# EAGLE design 612_jetracer_esp32s3_030100 (EAGLE 9.6.2)
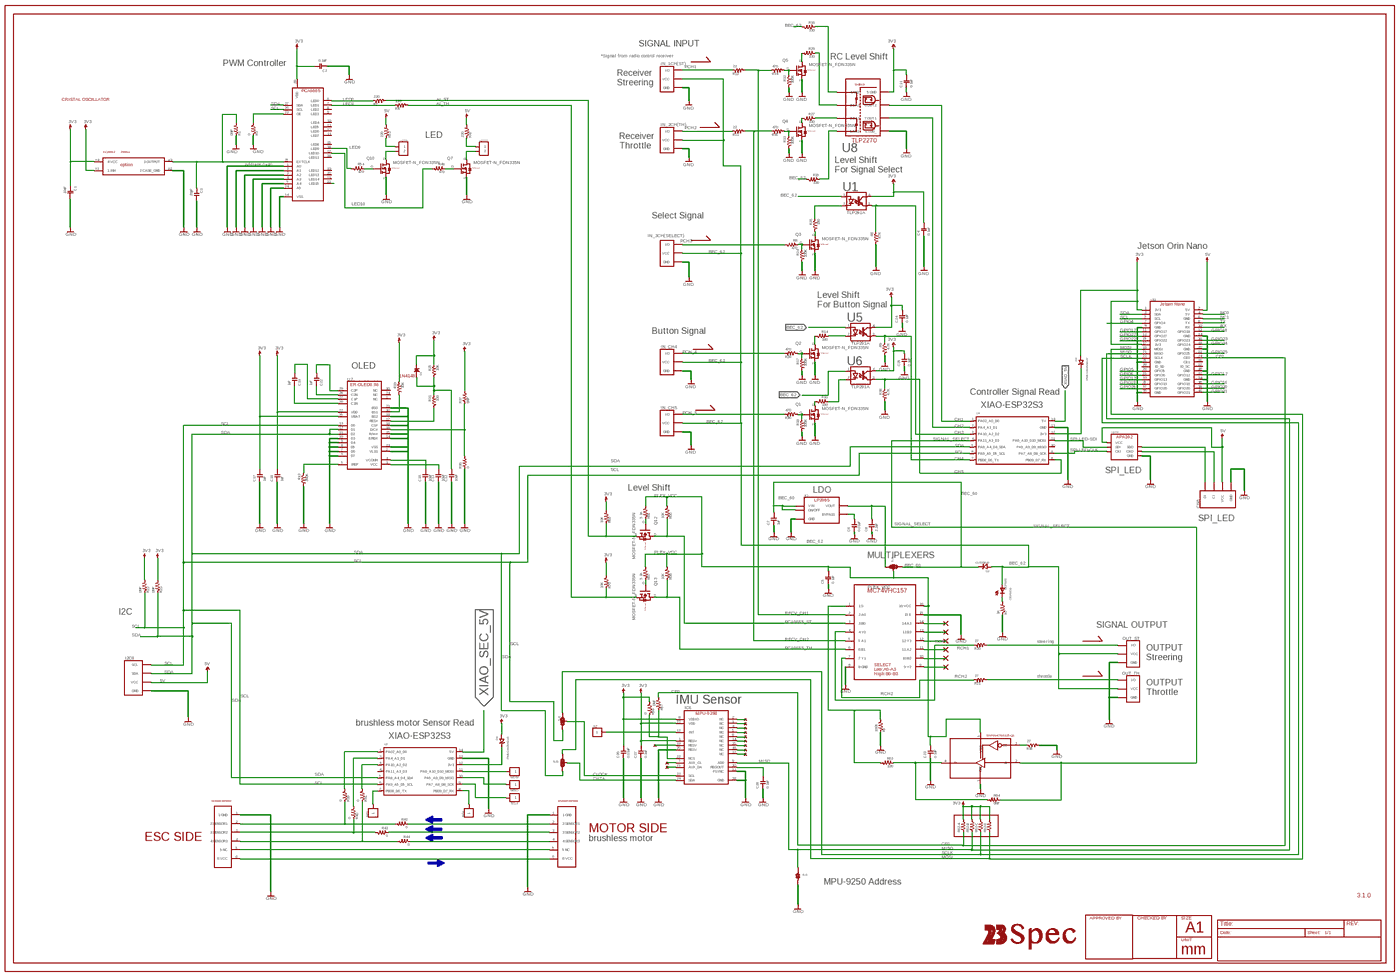
[diagram p0: schematic, sheet 1, overview]
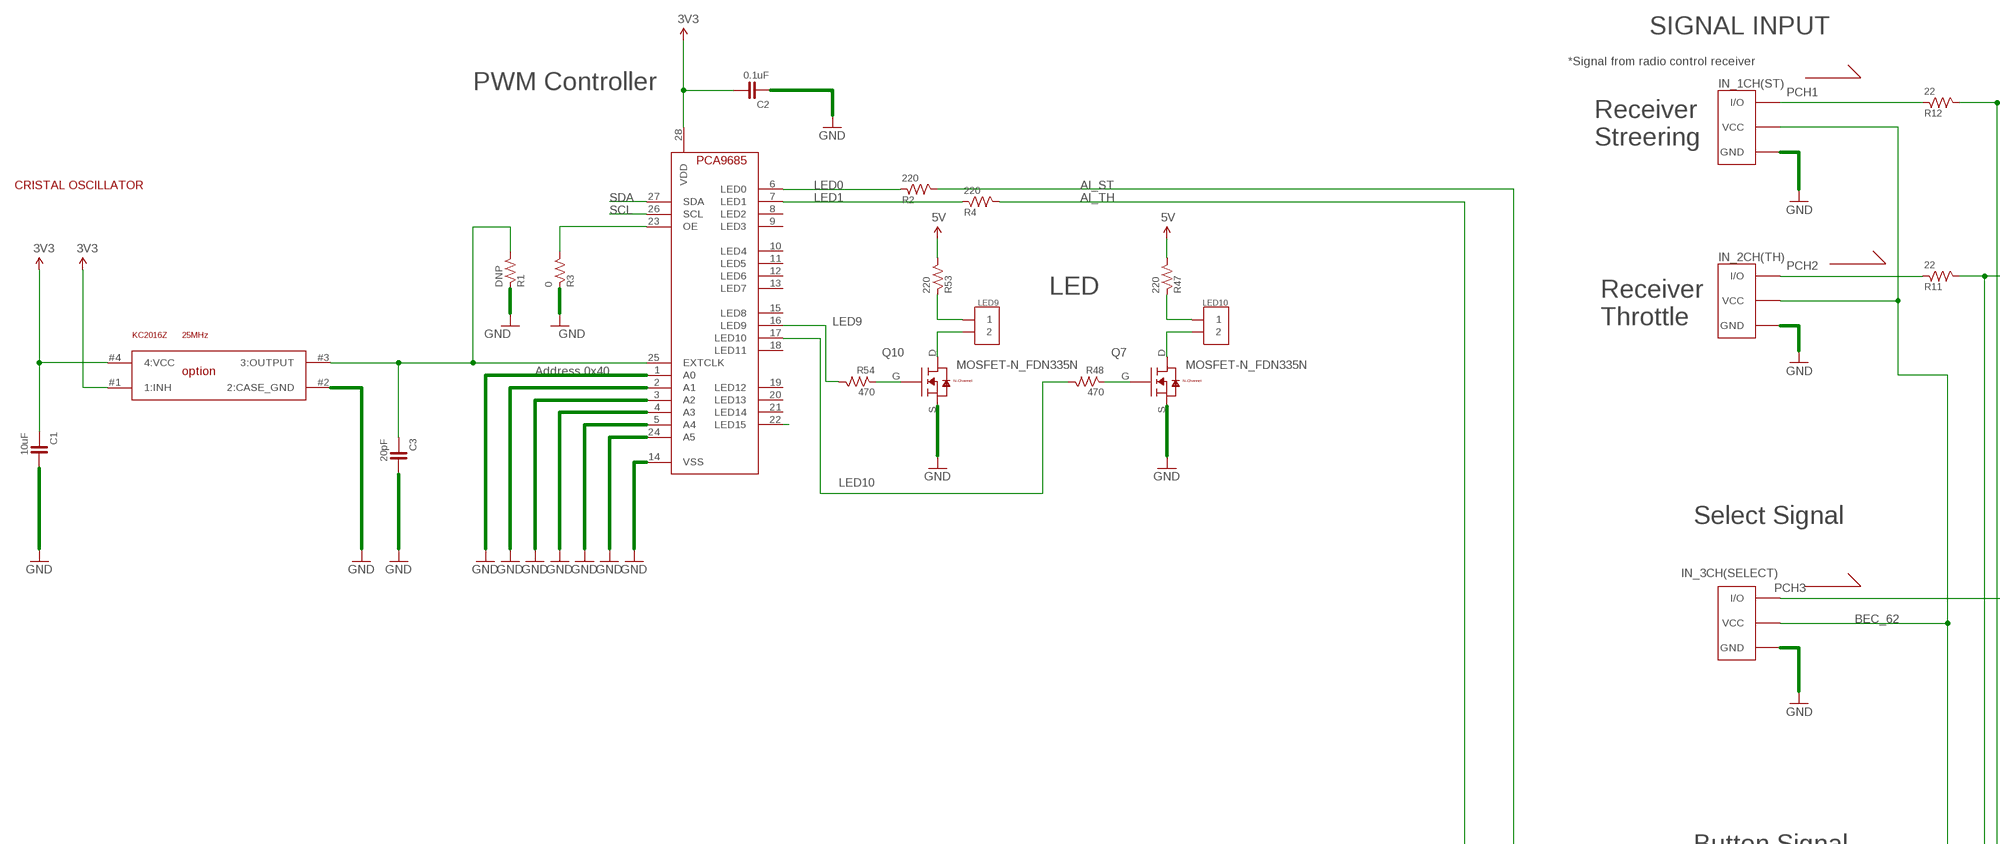
[diagram p1: schematic, sheet 1, part 1 of 4]
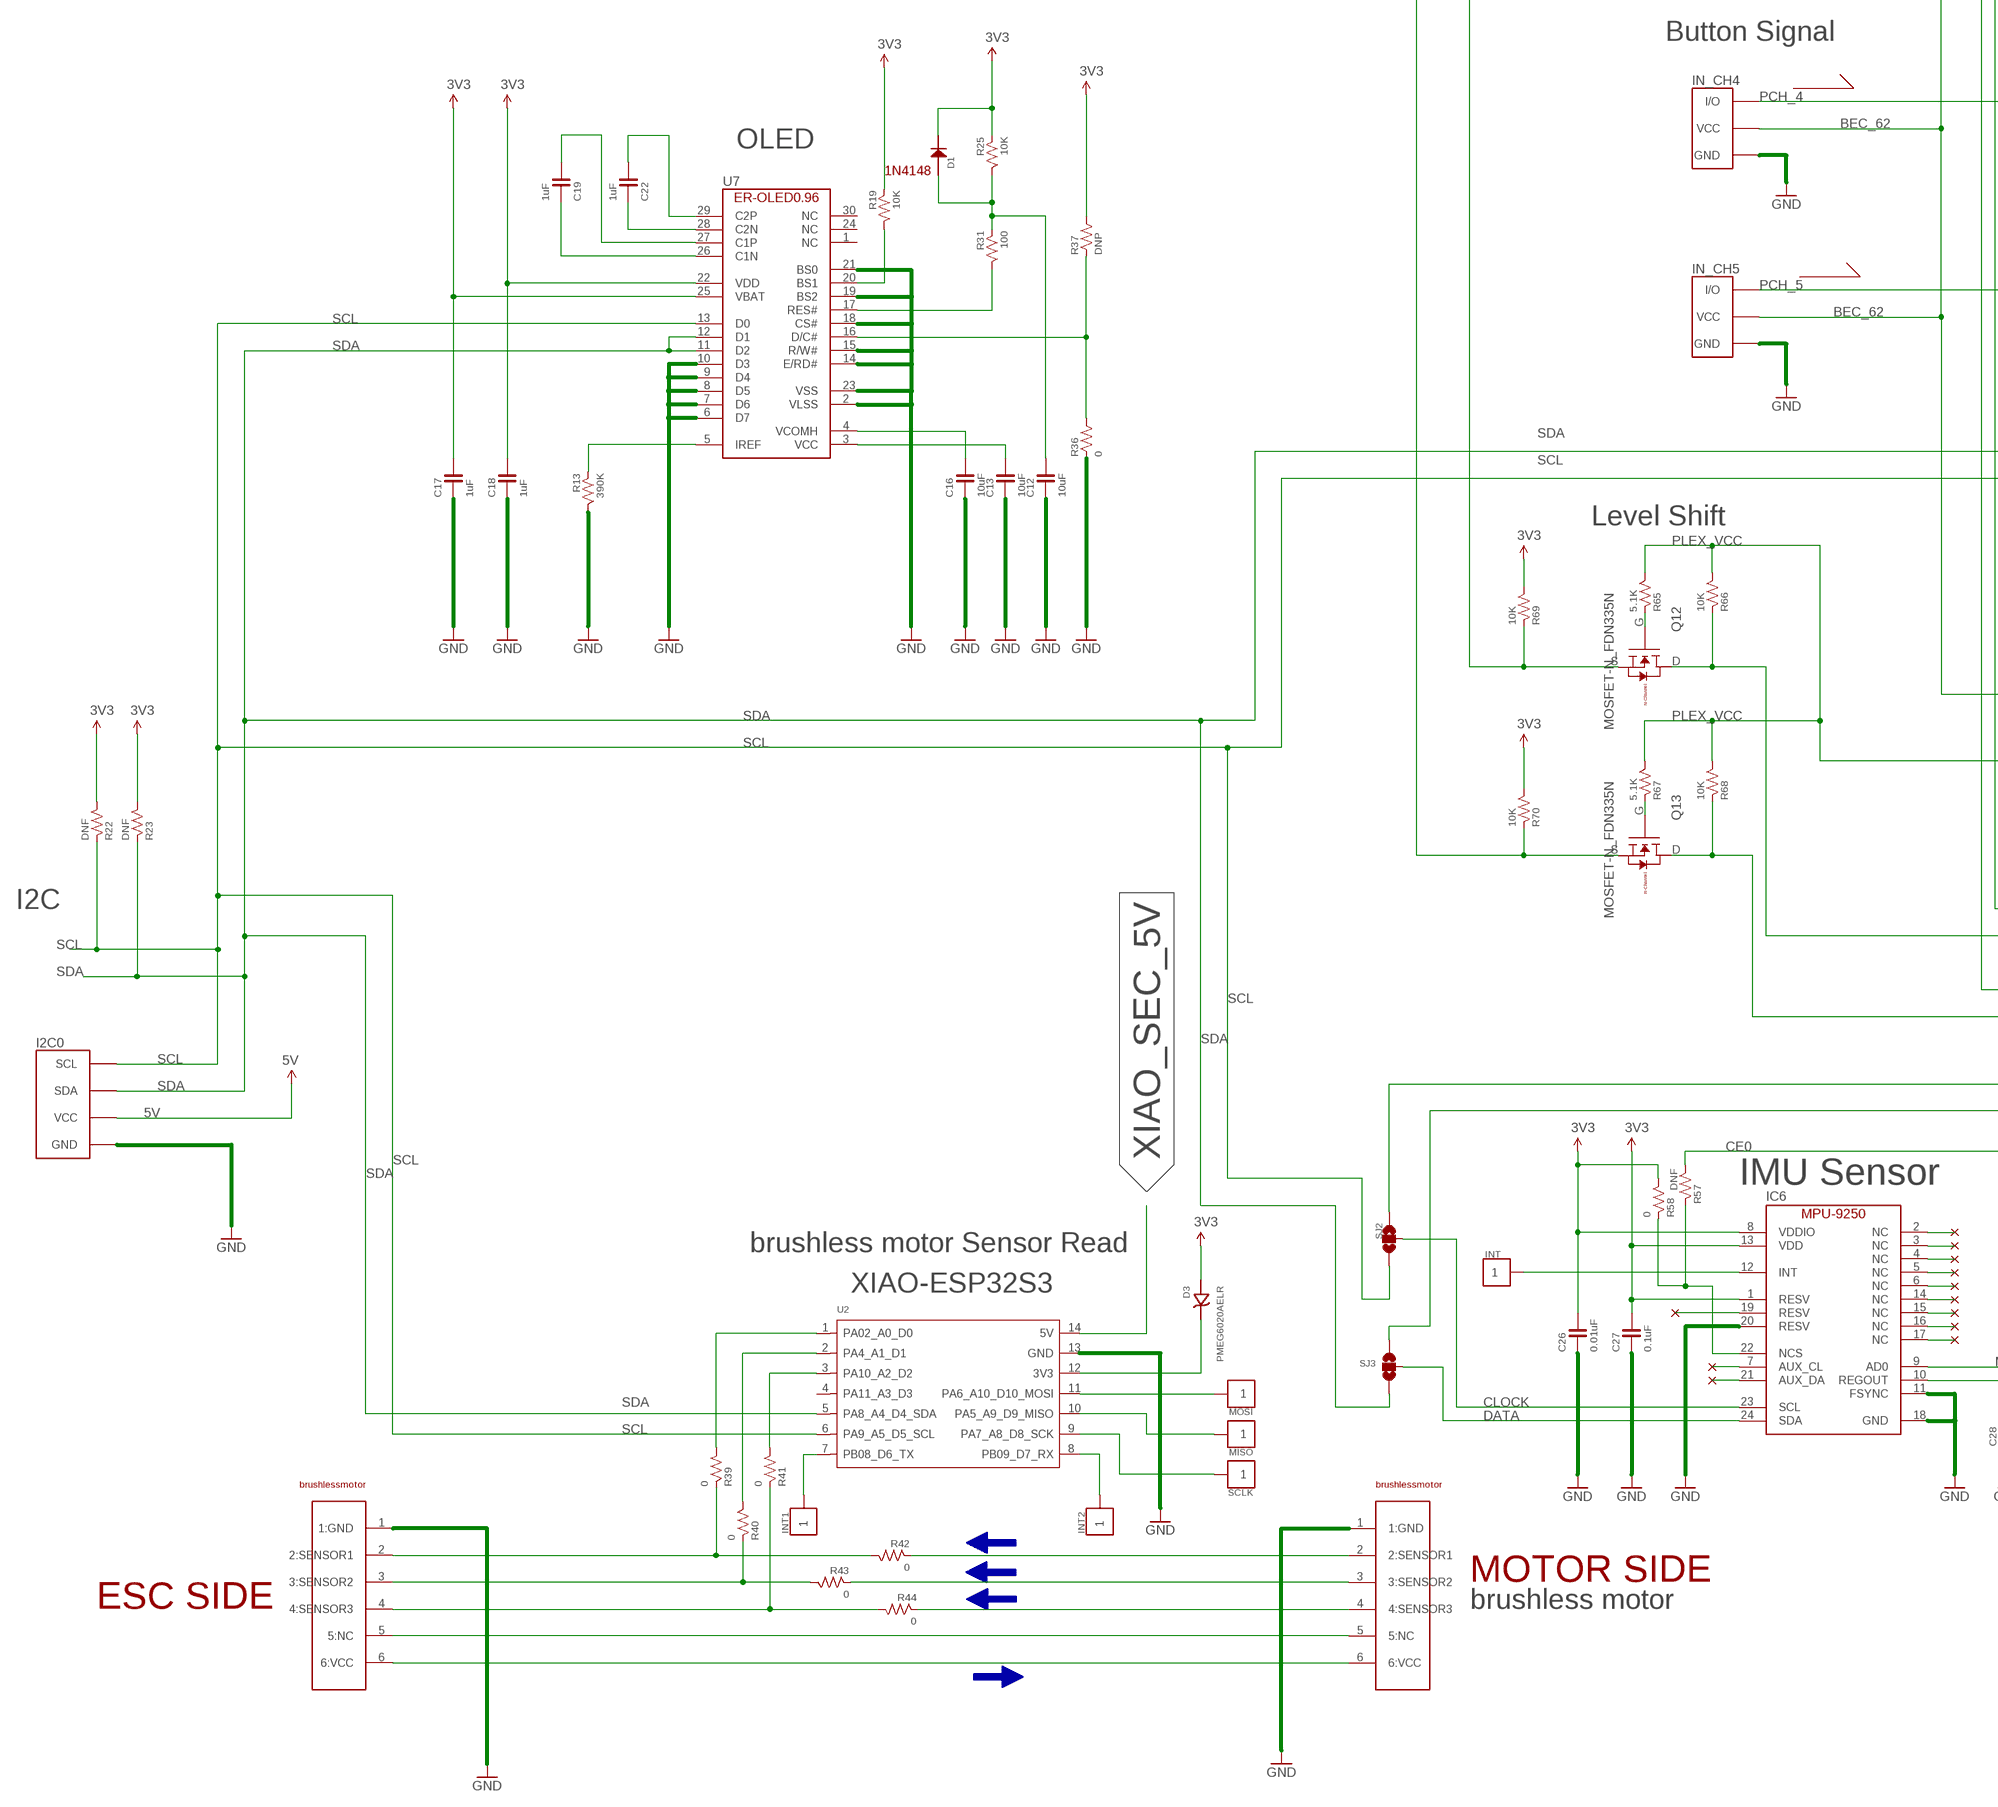
[diagram p2: schematic, sheet 1, part 2 of 4]
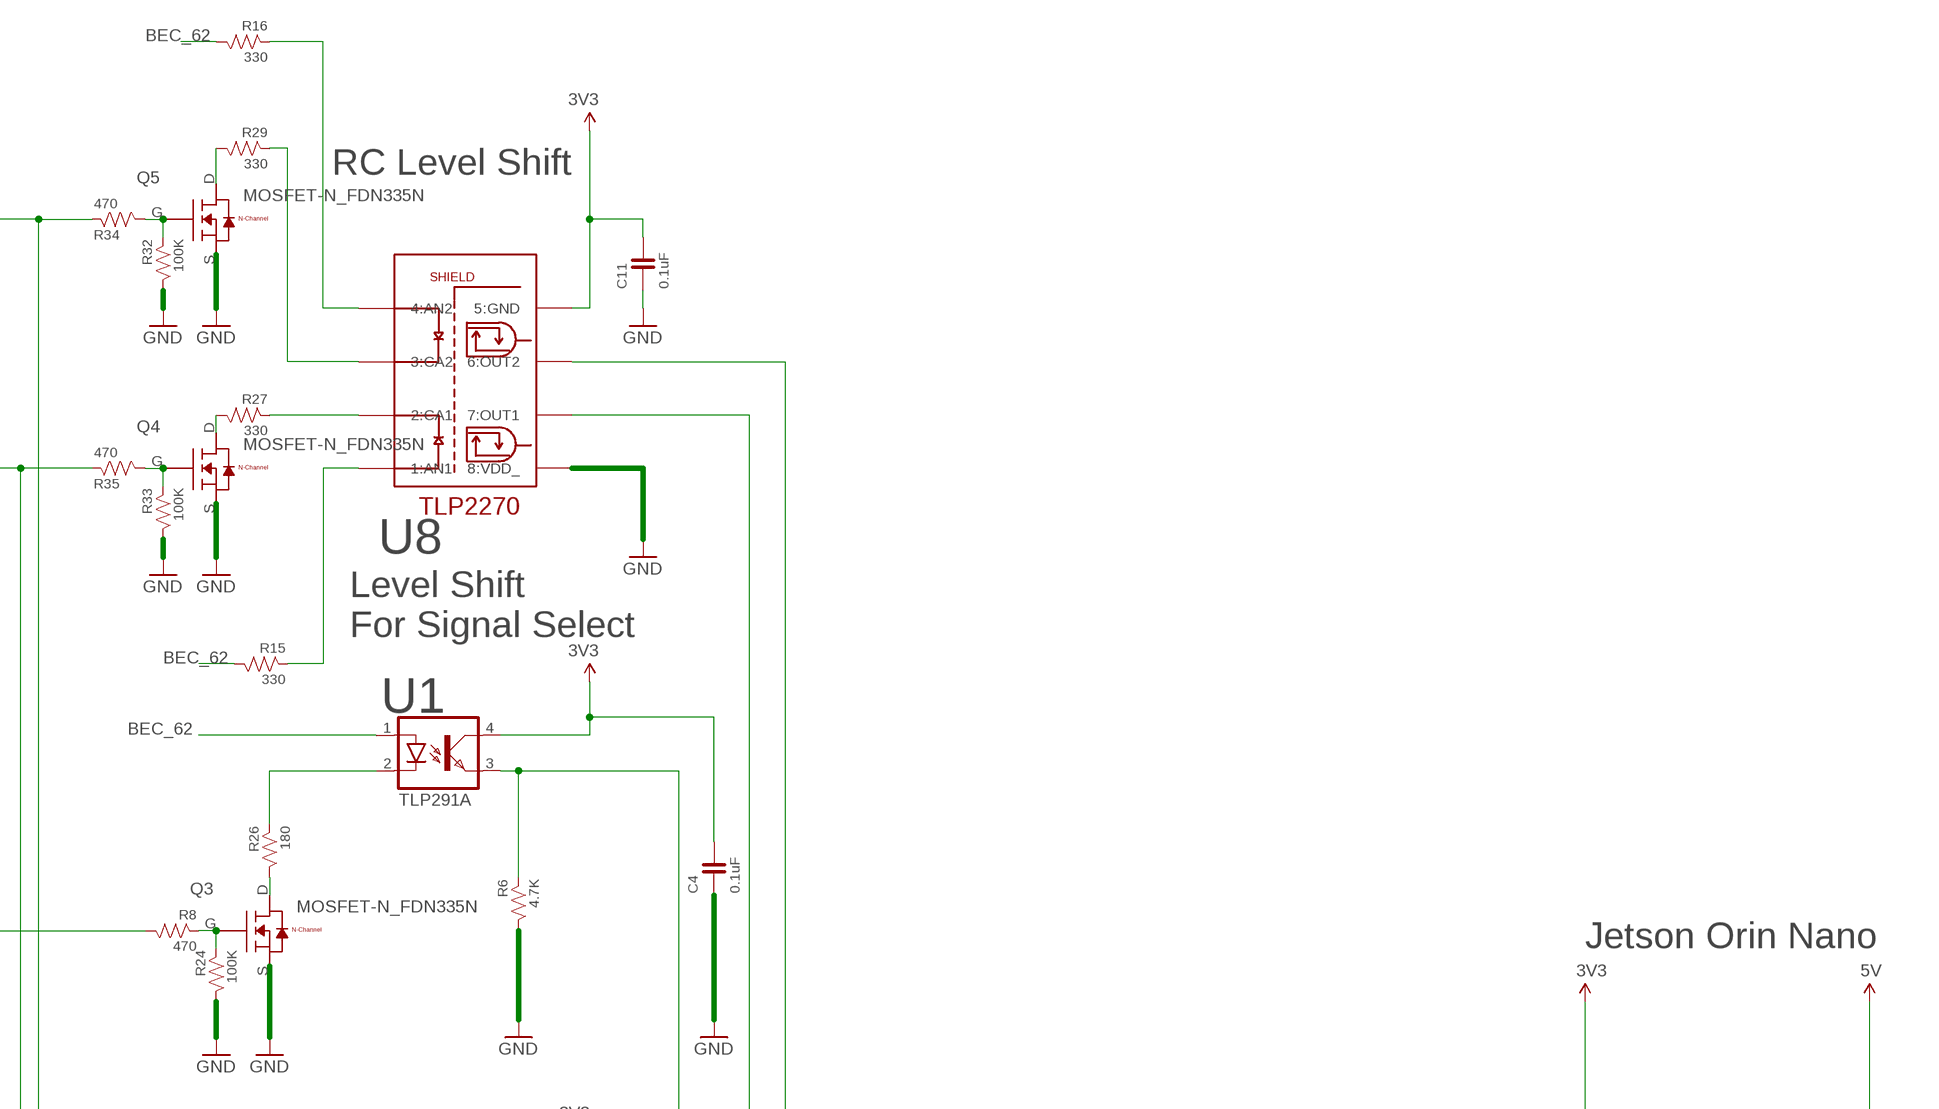
[diagram p3: schematic, sheet 1, part 3 of 4]
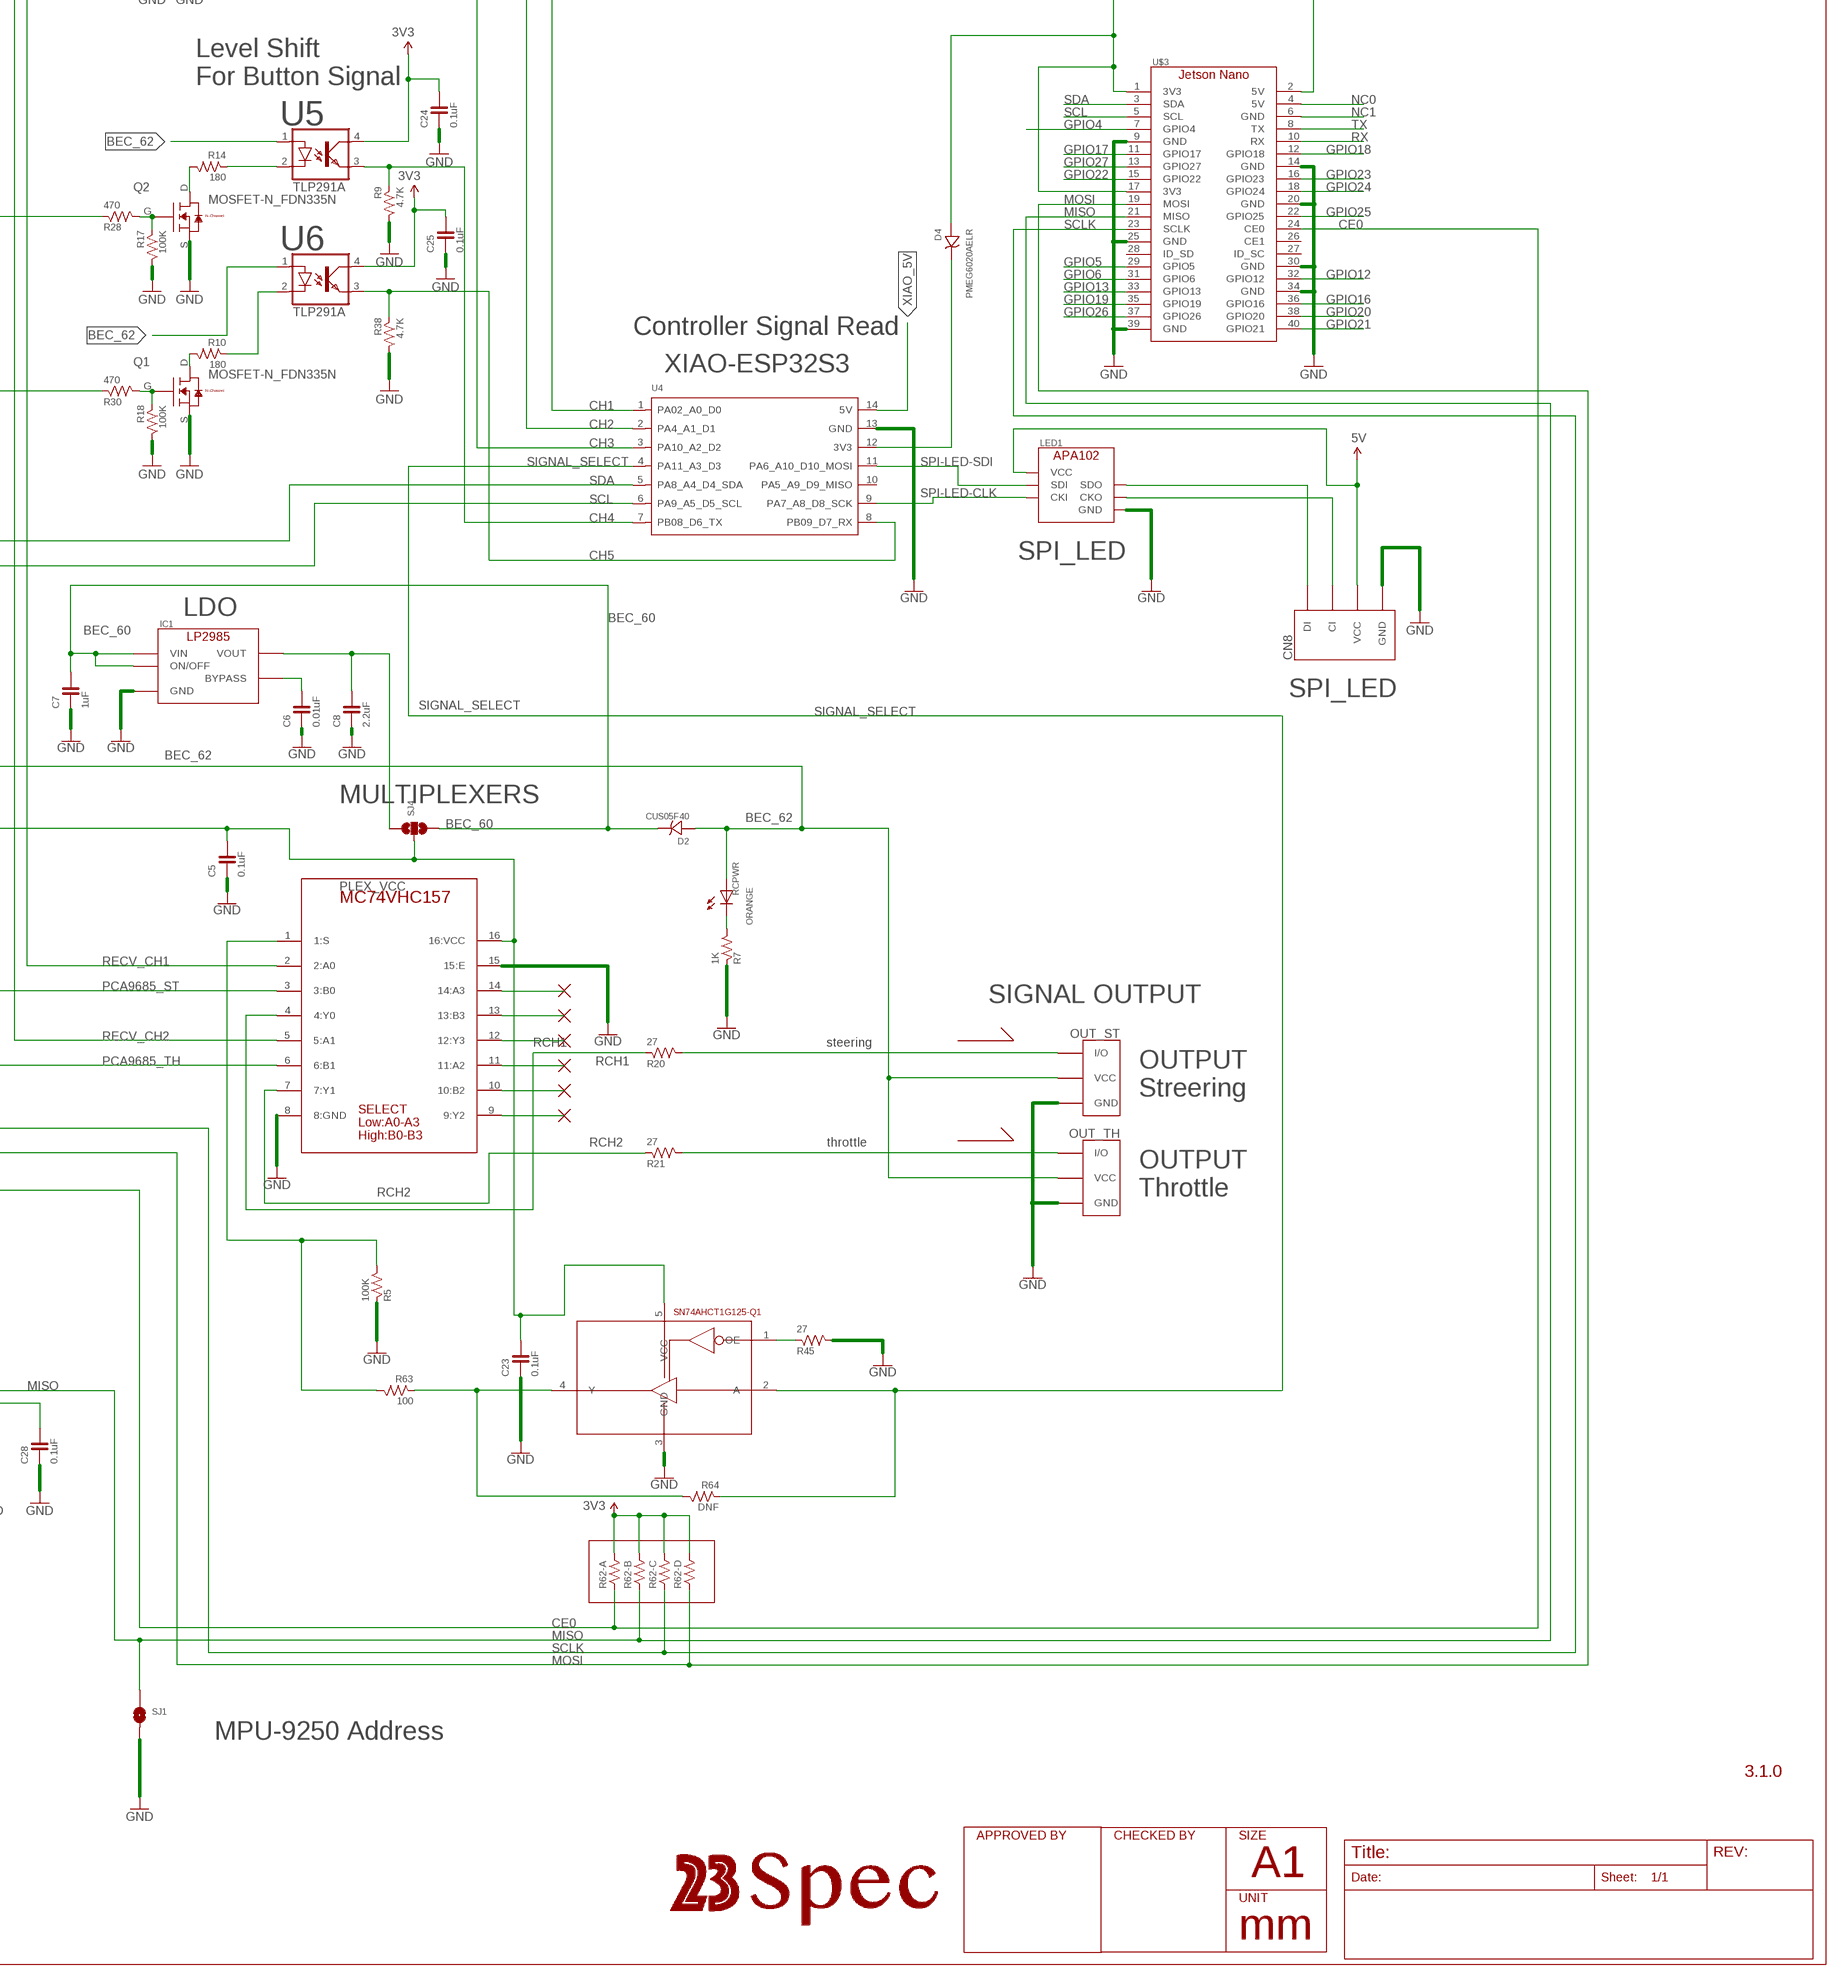
[diagram p4: schematic, sheet 1, part 4 of 4]

## Parts
C1  10uF  CAPACITOR-0603  [0603]
C2  0.1uF  CAPACITOR-0603  [0603]
C3  20pF  CAPACITOR-0603  [0603]
C4  0.1uF  CAPACITOR-0603  [0603]
C5  0.1uF  CAPACITOR-0603  [0603]
C6  0.01uF  CAPACITOR-0603  [0603]
C7  1uF  CAPACITOR-0603  [0603]
C8  2.2uF  CAPACITOR-0603  [0603]
C11  0.1uF  CAPACITOR-0603  [0603]
C12  10uF  CAPACITOR-0603  [0603]
C13  10uF  CAPACITOR-0603  [0603]
C16  10uF  CAPACITOR-0603  [0603]
C17  1uF  CAPACITOR-0603  [0603]
C18  1uF  CAPACITOR-0603  [0603]
C19  1uF  CAPACITOR-0603  [0603]
C22  1uF  CAPACITOR-0603  [0603]
C23  0.1uF  CAPACITOR-0603  [0603]
C24  0.1uF  CAPACITOR-0603  [0603]
C25  0.1uF  CAPACITOR-0603  [0603]
C26  0.01uF  CAPACITOR-0603  [0603]
C27  0.1uF  CAPACITOR-0603  [0603]
C28  0.1uF  CAPACITOR-0603  [0603]
CN8  FABO-SPI-LED-B04B  [SPI-B04B-PASK-1]
D1  1N4148  [1N4148W]
D2  CUS05F40  [CUS05F40]
D3  PMEG6020AELR  [SOD123W]
D4  PMEG6020AELR  [SOD123W]
I2C0  FABO_BRICK_I2C-B04B-PASK-1  [FABO_BRICK_I2C_B04B-PASK-1]
IC1  LP2985-33DBV  [SOT-23-5]
IC4  PCA9685_BOTTOM  [PCA9685_BOTTOM]
IC6  IS-MPU9250  [INVENSENSE-MPU9250]
IN_1CH(ST)  FABO_BRICK_3PIN-HEADER  [FABO_BRICK_3PIN_HEADER]
IN_2CH(TH)  FABO_BRICK_3PIN-HEADER  [FABO_BRICK_3PIN_HEADER]
IN_3CH(SELECT)  FABO_BRICK_3PIN-HEADER  [FABO_BRICK_3PIN_HEADER]
IN_CH4  FABO_BRICK_3PIN-HEADER  [FABO_BRICK_3PIN_HEADER]
IN_CH5  FABO_BRICK_3PIN-HEADER  [FABO_BRICK_3PIN_HEADER]
INT  PIN_1X1  [PIN_1X1]
INT1  PIN_1X1  [PIN_1X1]
INT2  PIN_1X1  [PIN_1X1]
LED1  APA102_IPIXEL  [APA102_2020]
LED9  PIN_1X2  [PIN_1X2]
LED10  PIN_1X2  [PIN_1X2]
MISO  PIN_1X1  [PIN_1X1]
MOSI  PIN_1X1  [PIN_1X1]
OUT_ST  FABO_BRICK_3PIN-HEADER  [FABO_BRICK_3PIN_HEADER]
OUT_TH  FABO_BRICK_3PIN-HEADER  [FABO_BRICK_3PIN_HEADER]
Q1  MOSFET-N_FDN335N  [SUPERSOT-3]
Q2  MOSFET-N_FDN335N  [SUPERSOT-3]
Q3  MOSFET-N_FDN335N  [SUPERSOT-3]
Q4  MOSFET-N_FDN335N  [SUPERSOT-3]
Q5  MOSFET-N_FDN335N  [SUPERSOT-3]
Q7  MOSFET-N_FDN335N  [SUPERSOT-3]
Q10  MOSFET-N_FDN335N  [SUPERSOT-3]
Q12  MOSFET-N_FDN335N  [SUPERSOT-3]
Q13  MOSFET-N_FDN335N  [SUPERSOT-3]
R1  DNP  RESISTOR-0603  [0603]
R2  220  RESISTOR-0603  [0603]
R3  0  RESISTOR-0603  [0603]
R4  220  RESISTOR-0603  [0603]
R5  100K  RESISTOR-0603  [0603]
R6  4.7K  RESISTOR-0603  [0603]
R7  1K  RESISTOR-0603  [0603]
R8  470  RESISTOR-0603  [0603]
R9  4.7K  RESISTOR-0603  [0603]
R10  180  RESISTOR-0603  [0603]
R11  22  RESISTOR-0603  [0603]
R12  22  RESISTOR-0603  [0603]
R13  390K  RESISTOR-0603  [0603]
R14  180  RESISTOR-0603  [0603]
R15  330  RESISTOR-0603  [0603]
R16  330  RESISTOR-0603  [0603]
R17  100K  RESISTOR-0603  [0603]
R18  100K  RESISTOR-0603  [0603]
R19  10K  RESISTOR-0603  [0603]
R20  27  RESISTOR-0603  [0603]
R21  27  RESISTOR-0603  [0603]
R22  DNF  RESISTOR-0603  [0603]
R23  DNF  RESISTOR-0603  [0603]
R24  100K  RESISTOR-0603  [0603]
R25  10K  RESISTOR-0603  [0603]
R26  180  RESISTOR-0603  [0603]
R27  330  RESISTOR-0603  [0603]
R28  470  RESISTOR-0603  [0603]
R29  330  RESISTOR-0603  [0603]
R30  470  RESISTOR-0603  [0603]
R31  100  RESISTOR-0603  [0603]
R32  100K  RESISTOR-0603  [0603]
R33  100K  RESISTOR-0603  [0603]
R34  470  RESISTOR-0603  [0603]
R35  470  RESISTOR-0603  [0603]
R36  0  RESISTOR-0805  [0805]
R37  DNP  RESISTOR-0805  [0805]
R38  4.7K  RESISTOR-0603  [0603]
R39  0  RESISTOR-0603  [0603]
R40  0  RESISTOR-0603  [0603]
R41  0  RESISTOR-0603  [0603]
R42  0  RESISTOR-0603  [0603]
R43  0  RESISTOR-0603  [0603]
R44  0  RESISTOR-0603  [0603]
R45  27  RESISTOR-0603  [0603]
R47  220  RESISTOR-0603  [0603]
R48  470  RESISTOR-0603  [0603]
R53  220  RESISTOR-0603  [0603]
R54  470  RESISTOR-0603  [0603]
R57  DNF  RESISTOR-0603  [0603]
R58  0  RESISTOR-0603  [0603]
R62  RESISTOR_ARRAY_4  [EXBV8V]
R63  100  RESISTOR-0603  [0603]
R64  DNF  RESISTOR-0603  [0603]
R65  5.1K  RESISTOR-0603  [0603]
R66  10K  RESISTOR-0603  [0603]
R67  5.1K  RESISTOR-0603  [0603]
R68  10K  RESISTOR-0603  [0603]
R69  10K  RESISTOR-0603  [0603]
R70  10K  RESISTOR-0603  [0603]
RCPWR  ORANGE  LED-0603  [0603]
SCLK  PIN_1X1  [PIN_1X1]
SJ1  FABO-SMD-JUMPER-SELECT  [SMD-JUMPER_SELECT]
SJ2  SMD-JUMPER-3_23SHORT  [SMD-JUMPER-3-23SHORT]
SJ3  SMD-JUMPER-3_23SHORT  [SMD-JUMPER-3-23SHORT]
SJ4  SMD-JUMPER-3_23SHORT  [SMD-JUMPER-3-23SHORT]
U1  TLP291A  [11-3C1]
U2  MOUDLE-SEEEDUINO-XIAO-ESP32S3-SMD  [MOUDLE14P-SMD-2.54-21X17.8MM]
U4  MOUDLE-SEEEDUINO-XIAO-ESP32S3-SMD  [MOUDLE14P-SMD-2.54-21X17.8MM]
U5  TLP291A  [11-3C1]
U6  TLP291A  [11-3C1]
U7  ER-OLED0.96-1ER-CON30HT-1  [ER-CON30HT-1]
U8  TLP2270  [TLP2270]
U$1  MC74VHC157  [MC74VHC157_TSSOP-16]
U$3  JETSON_NANOJETSON_ORIN_NANO  [JETSON_ORIN_NANO_DIMENTION]
U$8  SN74AHCT1G125-Q1  [SC70]
U$9  BRUSHLESSMOTOR_CON  [B6B-ZR]
U$10  BRUSHLESSMOTOR_CON  [B6B-ZR]
U$11  KC2016Z  [KC2016Z]

## Nets
3V3: C1.1 C2.2 C4.2 C11.2 C17.2 C18.2 C24.2 C25.2 C26.2 C27.2 D1.CATHODE D3.2(ANODE) D4.2(ANODE) IC4.28(VDD) IC6.1(RESV) IC6.8(VDDIO) IC6.13(VDD) R19.1 R22.2 R23.2 R25.1 R37.2 R58.2 R62.5 R62.6 R62.7 R62.8 R69.2 R70.2 U1.4(COL) U5.4(COL) U6.4(COL) U7.22(VDD) U7.25(VBAT) U8.5(5:GND) U$3.1(3V3) U$3.17(3V3) U$11.#1(1:INH) U$11.#4(4:VCC)
5V: CN8.VCC I2C0.VCC LED1.VCC R47.2 R53.2 U$3.2(5V)
AI_ST: Q12.S R2.2 R69.1
AI_TH: Q13.S R4.2 R70.1
BEC_60: C7.2 D2.C(CATHODE) IC1.1(VIN) IC1.3(ON/OFF) SJ4.3
BEC_62: D2.A(ANODE) IN_1CH(ST).VCC IN_2CH(TH).VCC IN_3CH(SELECT).VCC IN_CH4.VCC IN_CH5.VCC OUT_ST.VCC OUT_TH.VCC R15.2 R16.2 RCPWR.ANODE U1.1(A) U5.1(A) U6.1(A)
CE0: R57.2 R62.1 U$3.24(CE0)
CH1: U4.1(PA02_A0_D0) U8.6(6:OUT2)
CH2: U4.2(PA4_A1_D1) U8.7(7:OUT1)
CH3: R6.1 U1.3(EMI) U4.3(PA10_A2_D2)
CH4: R9.1 U4.7(PB08_D6_TX) U5.3(EMI)
CH5: R38.1 U4.8(PB09_D7_RX) U6.3(EMI)
CLOCK: IC6.23(SCL) SJ2.2
DATA: IC6.24(SDA) SJ3.2
GND: C1.2 C2.1 C3.2 C4.1 C5.1 C6.1 C7.1 C8.1 C11.1 C12.1 C13.1 C16.1 C17.1 C18.1 C23.1 C24.1 C25.1 C26.1 C27.1 C28.1 CN8.GND I2C0.GND IC1.2(GND) IC4.1(A0) IC4.2(A1) IC4.3(A2) IC4.4(A3) IC4.5(A4) IC4.14(VSS) IC4.24(A5) IC6.11(FSYNC) IC6.18(GND) IC6.20(RESV) IN_1CH(ST).GND IN_2CH(TH).GND IN_3CH(SELECT).GND IN_CH4.GND IN_CH5.GND LED1.GND OUT_ST.GND OUT_TH.GND Q1.S Q2.S Q3.S Q4.S Q5.S Q7.S Q10.S R1.1 R3.1 R5.1 R6.2 R7.1 R9.2 R13.2 R17.2 R18.2 R24.2 R32.2 R33.2 R36.1 R38.2 R45.2 SJ1.2 U2.13(GND) U4.13(GND) U7.2(VLSS) U7.6(D7) U7.7(D6) U7.8(D5) U7.9(D4) U7.10(D3) U7.14(E/RD#) U7.15(R/W#) U7.18(CS#) U7.19(BS2) U7.21(BS0) U7.23(VSS) U8.8(8:VDD_) U$1.8(8:GND) U$1.15(15:E) U$3.9(GND) U$3.14(GND) U$3.20(GND) U$3.25(GND) U$3.30(GND) U$3.34(GND) U$3.39(GND) U$8.3(GND) U$9.1(1:GND) U$10.1(1:GND) U$11.#2(2:CASE_GND)
GPIO4: U$3.7(GPIO4)
GPIO5: U$3.29(GPIO5)
GPIO6: U$3.31(GPIO6)
GPIO12: U$3.32(GPIO12)
GPIO13: U$3.33(GPIO13)
GPIO16: U$3.36(GPIO16)
GPIO17: U$3.11(GPIO17)
GPIO18: U$3.12(GPIO18)
GPIO19: U$3.35(GPIO19)
GPIO20: U$3.38(GPIO20)
GPIO21: U$3.40(GPIO21)
GPIO22: U$3.15(GPIO22)
GPIO23: U$3.16(GPIO23)
GPIO24: U$3.18(GPIO24)
GPIO25: U$3.22(GPIO25)
GPIO26: U$3.37(GPIO26)
GPIO27: U$3.13(GPIO27)
LED0: IC4.6(LED0) R2.1
LED1: IC4.7(LED1) R4.1
LED9: IC4.16(LED9) R54.2
LED9-D: LED9.2 Q10.D
LED9_G: Q10.G R54.1
LED10: IC4.17(LED10) R48.2
LED10-D: LED10.2 Q7.D
LED10-G: Q7.G R48.1
MISO: IC6.9(AD0) R62.2 SJ1.1 U$3.21(MISO)
MOSI: R62.4 SJ3.1 U$3.19(MOSI)
MOTORCONTROLPOWER: U$9.6(6:VCC) U$10.6(6:VCC)
N$2: IC6.22(NCS) R57.1 R58.1
N$3: C22.2 U7.29(C2P)
N$4: R5.2 R63.2 U$1.1(1:S)
N$5: IC6.12(INT) INT.1
N$6: R26.1 U1.2(C)
N$7: IC4.23(OE) R3.2
N$8: IC6.2(NC)
N$9: R15.1 U8.1(1:AN1)
N$10: IC6.3(NC)
N$11: IC6.4(NC)
N$12: R16.1 U8.4(4:AN2)
N$13: CN8.DI LED1.SDO
N$14: R13.1 U7.5(IREF)
N$15: CN8.CI LED1.CKO
N$16: C19.2 U7.27(C1P)
N$17: C13.2 U7.3(VCC)
N$18: R31.2 U7.17(RES#)
N$19: U$1.13(13:B3)
N$20: R39.1 R42.2 U$9.2(2:SENSOR1)
N$21: C19.1 U7.26(C1N)
N$22: C22.1 U7.28(C2N)
N$23: Q3.G R8.1 R24.1
N$24: R7.2 RCPWR.CATHODE
N$25: C16.2 U7.4(VCOMH)
N$26: Q3.D R26.2
N$27: Q4.D R27.2
N$28: R27.1 U8.2(2:CA1)
N$29: Q5.D R29.2
N$30: R29.1 U8.3(3:CA2)
N$31: R40.1 R43.2 U$9.3(3:SENSOR2)
N$32: C12.2 D1.ANODE R25.2 R31.1
N$33: Q5.G R32.1 R34.2
N$34: D4.1(CATHODE) U4.12(3V3)
N$35: OUT_TH.I/O R21.2
N$36: OUT_ST.I/O R20.2
N$37: R36.2 R37.1 U7.16(D/C#)
N$38: Q4.G R33.1 R35.2
N$39: U$1.11(11:A2)
N$40: R41.1 R44.2 U$9.4(4:SENSOR3)
N$41: C3.1 IC4.25(EXTCLK) R1.2 U$11.#3(3:OUTPUT)
N$42: U$9.5(5:NC) U$10.5(5:NC)
N$43: IC6.5(NC)
N$44: IC6.6(NC)
N$45: D3.1(CATHODE) U2.12(3V3)
N$46: Q1.D R10.2
N$47: Q2.D R14.2
N$48: Q2.G R17.1 R28.2
N$49: Q1.G R18.1 R30.2
N$50: R19.2 U7.20(BS1)
N$51: R14.1 U5.2(C)
N$52: R10.1 U6.2(C)
N$53: IC6.14(NC)
N$54: IC6.15(NC)
N$55: R39.2 U2.1(PA02_A0_D0)
N$56: R40.2 U2.2(PA4_A1_D1)
N$57: R41.2 U2.3(PA10_A2_D2)
N$58: R42.1 U$10.2(2:SENSOR1)
N$59: R43.1 U$10.3(3:SENSOR2)
N$60: R44.1 U$10.4(4:SENSOR3)
N$61: U$1.10(10:B2)
N$62: U$1.9(9:Y2)
N$63: U$1.12(12:Y3)
N$64: R45.1 U$8.1(OE)
N$65: C6.2 IC1.4(BYPASS)
N$66: LED10.1 R47.1
N$67: INT1.1 U2.7(PB08_D6_TX)
N$68: INT2.1 U2.8(PB09_D7_RX)
N$75: LED9.1 R53.1
N$85: IC4.22(LED15)
N$87: MOSI.1 U2.11(PA6_A10_D10_MOSI)
N$88: MISO.1 U2.10(PA5_A9_D9_MISO)
N$89: SCLK.1 U2.9(PA7_A8_D8_SCK)
N$95: R63.1 R64.2 U$8.4(Y)
N$96: Q12.G R65.1
N$97: IC6.16(NC)
N$98: IC6.17(NC)
N$99: Q13.G R67.1
N$100: IC6.7(AUX_CL)
N$105: U$1.14(14:A3)
N$107: IC6.21(AUX_DA)
N$108: IC6.19(RESV)
NC0: U$3.4(5V)
NC1: U$3.6(GND)
PCA9685_ST: Q12.D R66.1 U$1.3(3:B0)
PCA9685_TH: Q13.D R68.1 U$1.6(6:B1)
PCH1: IN_1CH(ST).I/O R12.1
PCH2: IN_2CH(TH).I/O R11.1
PCH3: IN_3CH(SELECT).I/O R8.2
PCH_4: IN_CH4.I/O R28.1
PCH_5: IN_CH5.I/O R30.1
PLEX_VCC: C5.2 C23.2 R65.2 R66.2 R67.2 R68.2 SJ4.2 U$1.16(16:VCC) U$8.5(VCC)
RC3V3: C8.2 IC1.5(VOUT) SJ4.1
RCH1: R20.1 U$1.4(4:Y0)
RCH2: R21.1 U$1.7(7:Y1)
RECV_CH1: R12.2 R34.1 U$1.2(2:A0)
RECV_CH2: R11.2 R35.1 U$1.5(5:A1)
REGOUT: C28.2 IC6.10(REGOUT)
RX: U$3.10(RX)
SCL: I2C0.SCL IC4.26(SCL) R22.1 SJ2.3 U2.6(PA9_A5_D5_SCL) U4.6(PA9_A5_D5_SCL) U7.13(D0) U$3.5(SCL)
SCLK: R62.3 SJ2.1 U$3.23(SCLK)
SDA: I2C0.SDA IC4.27(SDA) R23.1 SJ3.3 U2.5(PA8_A4_D4_SDA) U4.5(PA8_A4_D4_SDA) U7.11(D2) U7.12(D1) U$3.3(SDA)
SIGNAL_SELECT: R64.1 U4.4(PA11_A3_D3) U$8.2(A)
SPI-LED-CLK: LED1.CKI U4.9(PA7_A8_D8_SCK)
SPI-LED-SDI: LED1.SDI U4.11(PA6_A10_D10_MOSI)
TX: U$3.8(TX)
XIAO_5V: U4.14(5V)
XIAO_SEC_5V: U2.14(5V)
Unconnected: IC4.8(LED2) IC4.9(LED3) IC4.10(LED4) IC4.11(LED5) IC4.12(LED6) IC4.13(LED7) IC4.15(LED8) IC4.18(LED11) IC4.19(LED12) IC4.20(LED13) IC4.21(LED14) U2.4(PA11_A3_D3) U4.10(PA5_A9_D9_MISO) U7.1(NC) U7.24(NC) U7.30(NC) U$3.26(CE1) U$3.27(ID_SC) U$3.28(ID_SD)

## Notes on the sheet
- SIGNAL INPUT
- *Signal from radio control receiver
- RC Level Shift
- PWM Controller
- Receiver
  Streering
- CRISTAL OSCILLATOR
- LED
- Receiver
  Throttle
- option | Address 0x40
- Level Shift
  For Signal Select
- Select Signal
- Jetson Orin Nano
- Level Shift
  For Button Signal
- Button Signal
- OLED
- 1N4148
- Controller Signal Read
- XIAO-ESP32S3
- SPI_LED
- Level Shift | LDO
- SPI_LED
- MULTIPLEXERS
- I2C
- SIGNAL OUTPUT
- steering
- OUTPUT
  Streering
- throttle
- SELECT
  Low:A0-A3
  High:B0-B3
- OUTPUT
  Throttle
- IMU Sensor
- brushless motor Sensor Read
- XIAO-ESP32S3
- MOTOR SIDE
- ESC SIDE | brushless motor
- MPU-9250 Address
- 3.1.0

## Library data of the parts
C1-C8 C11-C13 C16-C19 C22-C28 = FaBo-Capacitor:CAPACITOR: CAPACITOR
CN8 = FaBo-Connetor:FABO-SPI-LED
D1 = FaBo-Diode:1N4148
D2 = FaBo-Diode:CUS05F40
D3 D4 = FaBo-Diode:PMEG6020AELR
I2C0 = FaBo-Template:FABO_BRICK_I2C: FaBo Brick I2C
IC1 = FaBo-Supply:LP2985: LP2985
IC4 = FaBo-Motor:PCA9685
IC6 = FaBo-Mems:IS-MPU9250: INVENSENSE MPU9250(9axis)
IN_1CH(ST) IN_2CH(TH) IN_3CH(SELECT) IN_CH4 IN_CH5 OUT_ST OUT_TH = FaBo-Template:FABO_BRICK_3PIN: FaBo Brick 3pin
INT INT1 INT2 MISO MOSI SCLK = FaBo-PIN:PIN_1X1
LED1 = FaBo-LED:APA102
LED9 LED10 = FaBo-PIN:PIN_1X2
Q1-Q5 Q7 Q10 Q12 Q13 = FaBo-Mosfet:MOSFET-N
R1-R36 R38-R45 R47 R48 R53 R54 R57 R58 R63-R70 = FaBo-Resistors:RESISTOR: RESISTOR
R37 = FaBo-Resistors:RESISTOR: RESISTOR; SPICEPREFIX: R
R62 = FaBo-Resistors:RESISTOR_ARRAY_4
RCPWR = FaBo-LED:LED
SJ1 = FaBo-PIN:FABO-SMD-JUMPER-SELECT
SJ2-SJ4 = FaBo-PIN:SMD-JUMPER-3
U1 U5 U6 = FaBo_Photocoupler:TLP291A
U2 U4 = Seeed-Studio-XIAO-ESP32S3-footprint-eagle:MOUDLE-SEEEDUINO-XIAO-ESP32S3
U7 = FaBo-Display:ER-OLED0.96-1: ER-CON30HT-1 Rev2 wide distance 0.23mm
U8 = FaBo-Photocoupler:TLP2270
U$1 = FaBo-Multiplexers:MC74VHC157
U$3 = FaBo-Boards:JETSON_NANO
U$8 = FaBo-LevelTranslator:SN74AHCT1G125-Q1: SN74AHCT1G125-Q1 SINGLE BUFFER GATE WITH 3 STATE OUTPUT
U$9 U$10 = FaBo-Connetor:BRUSHLESSMOTOR_CON: RCCAR brushless motor Signal
U$11 = FaBo-Crystal:KC2016Z

## Board
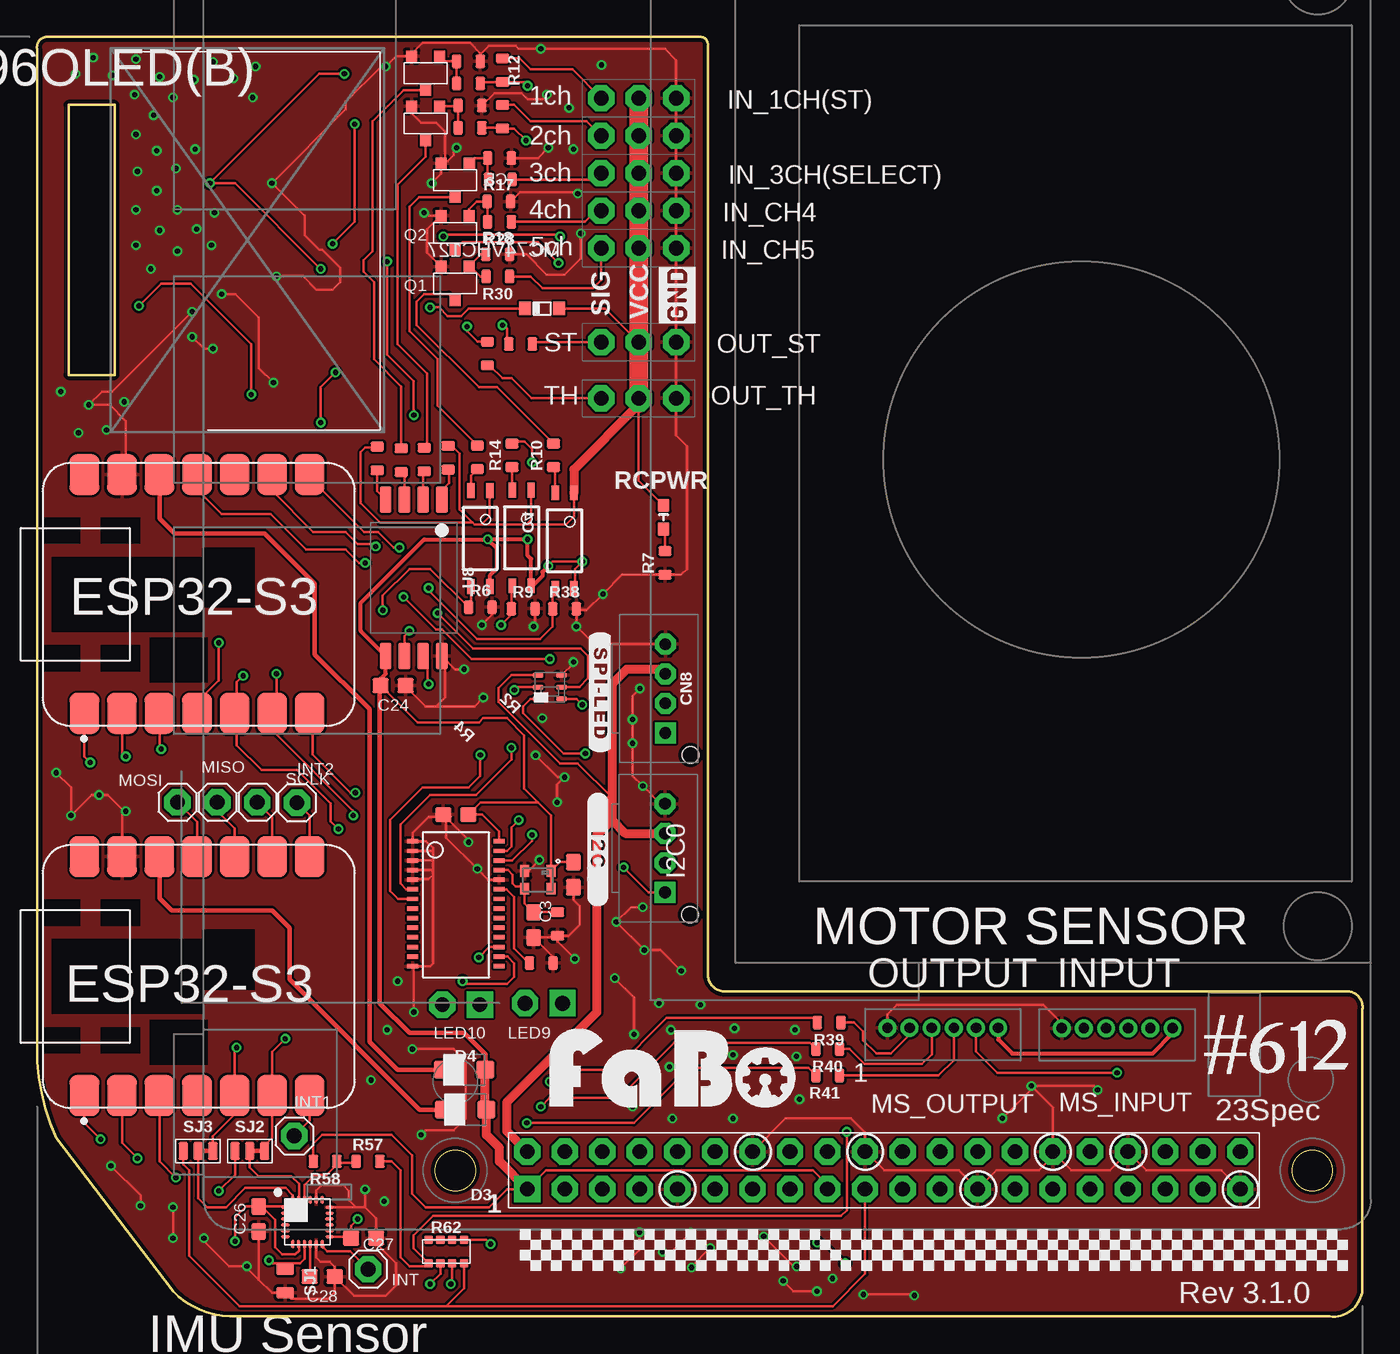
[diagram p5: board, top side]
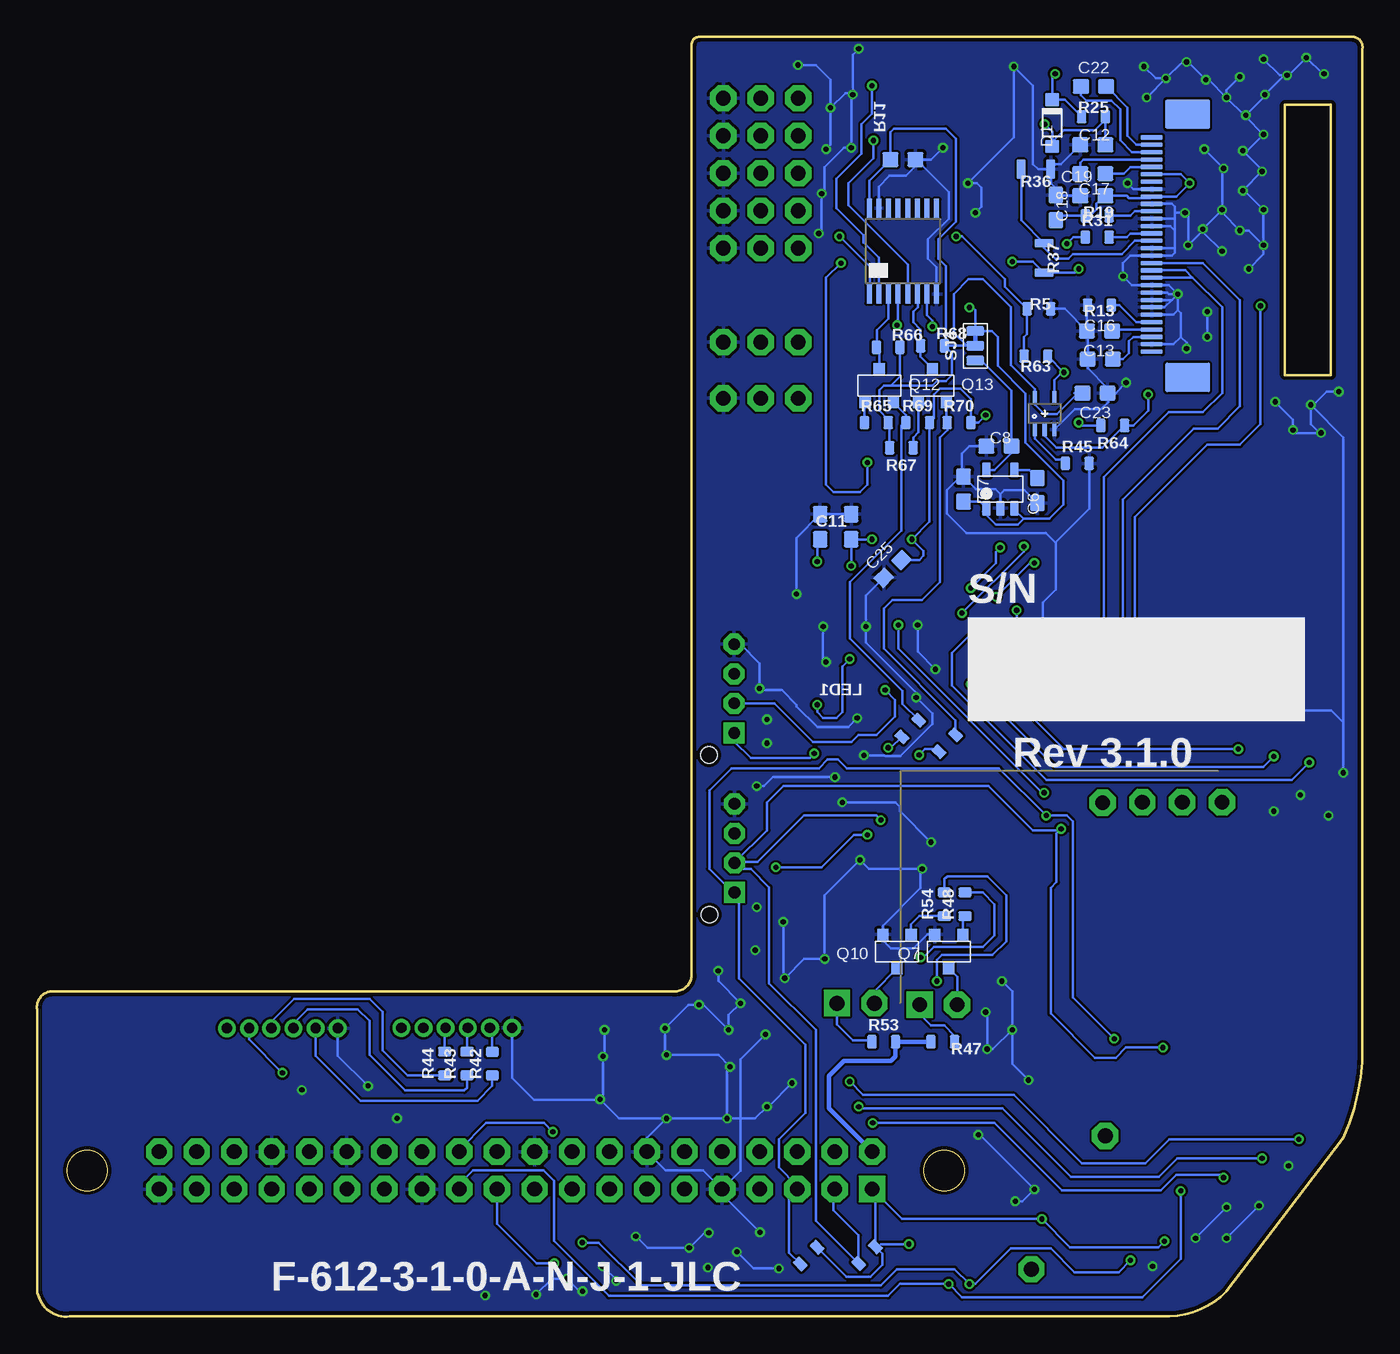
[diagram p6: board, bottom side, seen from below]

Size 89.72 x 86.61 mm. Coordinates in mm from the lower left corner, seen from the top.
Outline: 45.41,23.11 45.41,86.11 arc90 44.91,86.61 0.61,86.61 arc90 0.01,85.81 0.01,18.31 arc26 1.31,12.11 9.21,1.71 arc48 13.61,0.01 87.51,0.01 arc90 89.71,1.81 89.71,20.81 arc90 88.81,22.01 46.61,22.01 arc-90 45.41,23.11
Outline: 2.15,82.01 2.15,63.73 5.26,63.73 5.26,82.01 2.15,82.01
Copper layers (1*16): Top 0.035mm / dielectric 1.6mm / Bottom 0.035mm
Design rules "PCBway": minimum track width 6mil, minimum drill 12mil, track to track 6mil, track to pad 6mil, pad to pad 6mil, via to via 6mil, smd to smd 6mil, copper to edge 10mil, drill to drill 10mil, minimum pad ring 10mil, minimum via ring 6mil, stop-mask expansion 2mil, vias tented up to drill 100mil, thermal gap 8mil
bRestrict: 6 lines

### Footprints (pad centres in the part's own frame; a part is rotated, then mirrored left to right if it is on the bottom)
0603 = smd 1.1 x 1: 1 -0.85,0; 2 0.85,0
SPI-B04B-PASK-1 = drill 0.8 pad 1.422 octagon: CI 1,0.02; GND -3,0.02; VCC -1,0.02 | drill 0.8 pad 1.422 square: DI 3,0.02 | hole 1.1: 4.5,1.72
1N4148W = smd 0.9 x 0.95: ANODE 0,0; CATHODE 3.15,0
CUS05F40 = smd 0.8 x 0.9: A -1.15,0; C 1.15,0
SOD123W = smd 1.2 x 1.2: 1 -1.45,0; 2 1.45,0
FABO_BRICK_I2C_B04B-PASK-1 = drill 0.8 pad 1.422 octagon: GND -3,0; SDA 1,0; VCC -1,0 | drill 0.8 pad 1.422 square: SCL 3,0 | hole 1.1: 4.5,1.7
SOT-23-5 = smd 0.6 x 1.05: 1 -0.95,-1.3; 2 0,-1.3; 3 0.95,-1.3; 4 0.95,1.3; 5 -0.95,1.3
PCA9685_BOTTOM = smd 0.3 x 0.75 bottom: 1 4.3,-2.93; 2 3.65,-2.93; 3 3,-2.93; 4 2.35,-2.93; 5 1.7,-2.93; 6 1.05,-2.93; 7 0.4,-2.93; 8 -0.25,-2.93; 9 -0.9,-2.93; 10 -1.55,-2.93; 11 -2.2,-2.93; 12 -2.85,-2.93; 13 -3.5,-2.93; 14 -4.15,-2.93; 15 -4.15,2.92; 16 -3.5,2.92; 17 -2.85,2.92; 18 -2.2,2.92; 19 -1.55,2.92; 20 -0.9,2.92; 21 -0.25,2.92; 22 0.4,2.92; 23 1.05,2.92; 24 1.7,2.92; 25 2.35,2.92; 26 3,2.92; 27 3.65,2.92; 28 4.3,2.92
INVENSENSE-MPU9250 = smd 0.6 x 0.2: 1 -1.5,1; 2 -1.5,0.6; 3 -1.5,0.2; 4 -1.5,-0.2; 5 -1.5,-0.6; 6 -1.5,-1; 13 1.5,-1; 14 1.5,-0.6; 15 1.5,-0.2; 16 1.5,0.2; 17 1.5,0.6; 18 1.5,1 | smd 0.2 x 0.6: 7 -1,-1.5; 8 -0.6,-1.5; 9 -0.2,-1.5; 10 0.2,-1.5; 11 0.6,-1.5; 12 1,-1.5; 19 1,1.5; 20 0.6,1.5; 21 0.2,1.5; 22 -0.2,1.5; 23 -0.6,1.5; 24 -1,1.5
FABO_BRICK_3PIN_HEADER = drill 1 pad 1.778 octagon: GND -2.54,0; I/O 2.54,0; VCC 0,0
PIN_1X1 = drill 1 pad 1.778 octagon: 1 0,0
APA102_2020 = smd 0.7 x 0.35: CKI 0.8,0; CKO -0.8,0; GND 0.8,0.8; SDI 0.8,-0.8; SDO -0.8,-0.8; VCC -0.8,0.8
PIN_1X2 = drill 1 pad 1.778 square: 1 -1.27,0 | drill 1 pad 1.778 octagon: 2 1.27,0
SUPERSOT-3 = smd 0.76 x 0.76: D 0,1.15; G -0.95,-1.15; S 0.95,-1.15
0603' = smd 0.65 x 0.9: 1 -0.8,0; 2 0.8,0
0805 = smd 0.6 x 1.3: 1 -1,0; 2 1,0
EXBV8V = smd 0.6 x 0.6: 1 -1.2,-0.8; 2 -0.4,-0.8; 3 0.4,-0.8; 4 1.2,-0.8; 5 1.2,0.8; 6 0.4,0.8; 7 -0.4,0.8; 8 -1.2,0.8
0603'' = smd 0.9 x 0.8: ANODE -0.8,0; CATHODE 0.8,0
SMD-JUMPER_SELECT = smd 0.8 x 1.2: 1 -0.8,0; 2 0.8,0
SMD-JUMPER-3-23SHORT = smd 0.64 x 1.2: 1 -1,0; 2 0,0; 3 1,0
11-3C1 = smd 1 x 0.5: 1 -3.24,0.635; 2 -3.24,-0.635; 3 3.24,-0.635; 4 3.24,0.635
MOUDLE14P-SMD-2.54-21X17.8MM = smd 2.75 x 2: 1 0.835,18.12; 2 0.835,15.58; 3 0.835,13.04; 4 0.835,10.5; 5 0.835,7.96; 6 0.835,5.42; 7 0.835,2.88; 8 17,2.88; 9 17,5.42; 10 17,7.96; 11 17,10.5; 12 17,13.04; 13 17,15.58; 14 17,18.12
ER-CON30HT-1 = smd 0.3 x 1.5 bottom: 1 7,-0.23; 2 6.5,-0.23; 3 6,-0.23; 4 5.5,-0.23; 5 5,-0.23; 6 4.5,-0.23; 7 4,-0.23; 8 3.5,-0.23; 9 3,-0.23; 10 2.5,-0.23; 11 2,-0.23; 12 1.5,-0.23; 13 1,-0.23; 14 0.5,-0.23; 15 0,-0.23; 16 -0.5,-0.23; 17 -1,-0.23; 18 -1.5,-0.23; 19 -2,-0.23; 20 -2.5,-0.23; 21 -3,-0.23; 22 -3.5,-0.23; 23 -4,-0.23; 24 -4.5,-0.23; 25 -5,-0.23; 26 -5.5,-0.23; 27 -6,-0.23; 28 -6.5,-0.23; 29 -7,-0.23; 30 -7.5,-0.23 | smd 2 x 3 bottom: 31 -9.07,-2.67; 32 8.74,-2.67
TLP2270 = smd 0.8 x 1.8: 1 -1.905,-5.3; 2 -0.635,-5.3; 3 0.635,-5.3; 4 1.905,-5.3; 5 1.905,5.3; 6 0.635,5.3; 7 -0.635,5.3; 8 -1.905,5.3
MC74VHC157_TSSOP-16 = smd 1.26 x 0.36: 1 -2.9,2.275; 2 -2.9,1.625; 3 -2.9,0.975; 4 -2.9,0.325; 5 -2.9,-0.325; 6 -2.9,-0.975; 7 -2.9,-1.625; 8 -2.9,-2.275; 9 2.9,-2.275; 10 2.9,-1.625; 11 2.9,-0.975; 12 2.9,-0.325; 13 2.9,0.325; 14 2.9,0.975; 15 2.9,1.625; 16 2.9,2.275
JETSON_ORIN_NANO_DIMENTION = drill 1 pad 1.778 square: 1 21.9,2.7 | drill 1 pad 1.778 octagon: 2 21.9,5.24; 3 24.44,2.7; 4 24.44,5.24; 5 26.98,2.7; 6 26.98,5.24; 7 29.52,2.7; 8 29.52,5.24; 9 32.06,2.7; 10 32.06,5.24; 11 34.6,2.7; 12 34.6,5.24; 13 37.14,2.7; 14 37.14,5.24; 15 39.68,2.7; 16 39.68,5.24; 17 42.22,2.7; 18 42.22,5.24; 19 44.76,2.7; 20 44.76,5.24; 21 47.3,2.7; 22 47.3,5.24; 23 49.84,2.7; 24 49.84,5.24; 25 52.38,2.7; 26 52.38,5.24; 27 54.92,2.7; 28 54.92,5.24; 29 57.46,2.7; 30 57.46,5.24; 31 60,2.7; 32 60,5.24; 33 62.54,2.7; 34 62.54,5.24; 35 65.08,2.7; 36 65.08,5.24; 37 67.62,2.7; 38 67.62,5.24; 39 70.16,2.7; 40 70.16,5.24
SC70 = smd 0.35 x 0.85: 1 -0.65,-1.1; 2 0,-1.1; 3 0.65,-1.1; 4 0.65,1.1; 5 -0.65,1.1
B6B-ZR = drill 0.7 pad 1.016: 1 -3.75,0; 2 -2.25,0; 3 -0.75,0; 4 0.75,0; 5 2.25,0; 6 3.75,0
KC2016Z = smd 0.6 x 0.8: #1 -0.9,-0.6; #2 0.9,-0.6; #3 0.9,0.6; #4 -0.9,0.6

### Placement (x,y rotation side)
C1  36.31,29.91 270 top
C2  28.35,33.97 0 top
C3  33.61,26.51 270 top
C4  34.61,53.46 270 bottom
C5  31.11,78.31 180 bottom
C6  22.01,55.91 90 bottom
C7  27.01,56.01 270 bottom
C8  24.61,58.91 0 bottom
C11  36.71,53.46 270 bottom
C12  18.26,79.31 0 bottom
C13  17.76,64.81 0 bottom
C16  17.81,66.71 0 bottom
C17  18.26,75.86 0 bottom
C18  20.76,75.06 270 bottom
C19  18.26,77.36 180 bottom
C22  18.21,83.26 0 bottom
C23  18.11,62.51 180 bottom
C24  24.11,42.71 180 top
C25  31.81,50.61 45 bottom
C26  15.01,6.61 90 top
C27  22.11,5.31 180 top
C28  19.31,2.71 180 top
CN8  42.51,42.51 270 top
D1  21.01,79.21 90 bottom
D2  34.18,68.23 180 top
D3  28.98,14.01 0 top
D4  28.91,16.71 0 top
I2C0  42.51,31.71 270 top
IC1  24.51,56.01 0 bottom
IC4  28.35,27.87 90 bottom
IC6  18.31,6.41 0 top
IN_1CH(ST)  40.73,82.47 180 top
IN_2CH(TH)  40.73,79.93 180 top
IN_3CH(SELECT)  40.73,77.39 180 top
IN_CH4  40.73,74.85 180 top
IN_CH5  40.73,72.31 180 top
INT  22.41,3.21 0 top
INT1  17.42,12.23 0 top
INT2  17.6,34.78 0 top
LED1  34.71,42.61 0 top
LED9  34.31,21.21 180 top
LED10  28.71,21.11 180 top
MISO  12.21,34.81 0 top
MOSI  9.51,34.81 0 top
OUT_ST  40.73,65.96 180 top
OUT_TH  40.73,62.15 180 top
Q1  28.3,69.93 180 top
Q2  28.3,73.35 180 top
Q3  28.31,76.91 180 top
Q4  26.31,80.76 180 top
Q5  26.31,84.16 180 top
Q7  28.01,24.71 180 bottom
Q10  31.51,24.71 180 bottom
Q12  32.71,63.01 0 bottom
Q13  29.11,63.01 0 bottom
R1  DNP  [0603']  35.23,26.58 90 top
R2  220  [0603']  30.61,39.81 45 bottom
R3  0  [0603']  34.13,23.93 180 top
R4  220  [0603']  28.11,38.81 45 bottom
R5  100K  [0603']  21.91,68.21 180 bottom
R6  4.7K  [0603']  30.01,48.01 0 top
R7  1K  [0603']  42.51,51.01 90 top
R8  470  [0603']  31.36,76.96 0 top
R9  4.7K  [0603']  32.91,47.91 0 top
R10  180  [0603']  34.95,58.3 90 top
R11  22  [0603']  31.51,81.21 270 top
R12  22  [0603']  31.51,84.36 270 top
R13  390K  [0603']  17.81,68.46 180 bottom
R14  180  [0603']  32.15,58.3 90 top
R15  330  [0603']  27.83,58.13 90 top
R16  330  [0603']  23.03,58.08 90 top
R17  100K  [0603']  31.26,75.47 0 top
R18  100K  [0603']  31.18,71.9 0 top
R19  10K  [0603']  17.96,74.51 0 bottom
R20  27  [0603']  32.73,65.83 0 top
R21  27  [0603']  30.48,65.18 270 top
R22  DNF  [0603']  37.48,4.13 45 bottom
R23  DNF  [0603']  33.54,4.16 45 bottom
R24  100K  [0603']  31.31,78.41 0 top
R25  10K  [0603']  18.21,81.21 0 bottom
R26  180  [0603']  29.81,58.16 90 top
R27  330  [0603']  26.21,58.01 90 top
R28  470  [0603']  31.3,74.1 180 top
R29  330  [0603']  24.66,57.96 90 top
R30  470  [0603']  31.19,70.4 180 top
R31  100  [0603']  17.96,73.06 0 bottom
R32  100K  [0603']  29.21,84.96 0 top
R33  100K  [0603']  29.31,81.96 0 top
R34  470  [0603']  29.21,83.46 180 top
R35  470  [0603']  29.31,80.46 180 top
R36  22.11,77.66 180 bottom
R37  21.56,71.66 270 bottom
R38  4.7K  [0603']  35.71,47.91 0 top
R39  0  [0603']  53.62,19.91 180 top
R40  0  [0603']  53.52,18.12 180 top
R41  0  [0603']  53.52,16.32 180 top
R42  0  [0603']  58.9,17.13 90 bottom
R43  0  [0603']  60.62,17.13 90 bottom
R44  0  [0603']  62.12,17.14 90 bottom
R45  27  [0603']  19.31,57.75 0 bottom
R47  220  [0603']  28.41,18.61 180 bottom
R48  470  [0603']  26.91,27.91 90 bottom
R53  220  [0603']  32.41,18.61 0 bottom
R54  470  [0603']  28.31,27.91 90 bottom
R57  DNF  [0603']  22.41,10.51 0 top
R58  0  [0603']  19.51,10.51 180 top
R62  27.71,4.41 0 top
R63  100  [0603']  22.11,65.01 180 bottom
R64  DNF  [0603']  16.91,60.31 180 bottom
R65  5.1K  [0603']  32.91,60.51 0 bottom
R66  10K  [0603']  32.11,65.61 0 bottom
R67  5.1K  [0603']  31.21,58.81 180 bottom
R68  10K  [0603']  29.11,65.71 0 bottom
R69  10K  [0603']  30.11,60.51 0 bottom
R70  10K  [0603']  27.31,60.51 0 bottom
RCPWR  ORANGE  [0603'']  42.41,54.11 270 top
SCLK  14.91,34.81 0 top
SJ1  16.81,2.41 270 top
SJ2  14.41,11.21 0 top
SJ3  10.91,11.21 0 top
SJ4  26.21,65.71 90 bottom
U1  30.01,52.66 270 top
U2  21.34,14.13 90 top
U4  21.34,39.99 90 top
U5  32.81,52.71 270 top
U6  35.71,52.51 270 top
U7  14.51,72.31 270 top
U8  25.51,50.01 180 top
U$1  31.11,72.11 90 bottom
U$2  [LOGO_FABO_L]  42.31,14.16 0 top
U$3  11.28,5.93 0 top
U$8  21.52,61.13 0 bottom
U$9  61.31,19.54 0 top
U$10  73.11,19.52 0 top
U$11  33.91,29.56 180 top
U$12  [LOGO_SILK_GND]  44.59,67.22 90 top

### Tracks (layer width: path | path; a pad name or v marks a point on that pad's centre or on a via)
3V3  (via drill 0.35)
  Top 0.152: U6.4 36.41,49.33 36.41,50.61 v36.91,51.11 34.91,51.11 v34.61,50.81 | 33.41,49.5 U5.4 | 30.33,16.68 D4.2 30.43,16.64 | 23.38,42.83 C24.2 25.76,40.21 29.91,40.21 30.21,40.51 31.81,40.51 32.97,39.35 32.97,35.75 33.91,34.81 | IC4.28 31.27,32.84 30.14,33.97 C2.2 30.04,34.81 33.91,34.81 | U$11.#1 34.81,33.91 33.91,34.81 | 15.21,7.46 C26.2 14.16,7.46 13.41,6.71 v13.41,5.11 | 15.21,7.46 16.76,7.46 IC6.1 | IC6.13 21.16,5.41 C27.2 21.26,6.16 v21.71,6.61 | U$3.17 53.5,8.91 52.51,9.91 34.47,9.91 U$3.1 31.82,8.63 30.61,7.41 26.31,7.41 25.41,8.31 25.41,10.91 24.01,12.31 19.31,12.31 18.71,11.71 R58.2 | R62.8 R62.7 R62.6 R62.5 30.41,5.21 v30.71,4.91 | IC6.8 17.74,4.88 17.74,4.47 17.47,4.21 16.61,4.21 16.11,4.71 16.11,6.56 15.21,7.46 | U$11.#1 35.41,30.76 C1.1 | U$11.#4 U$11.#1 | v19.21,70.91 13.41,76.71 v11.71,76.71 19.11,84.11 v20.81,84.11 | v25.51,61.01 25.51,63.31 23.71,65.11 v23.71,71.41
  Top 0.254: v30.51,52.61 26.21,52.61 21.91,48.31 21.91,46.4 U8.5 23.61,43.51 23.26,43.16 C24.2 | v30.51,52.61 31.11,52.01 31.11,50.61 30.64,50.14 U1.4 | v30.51,52.61 v33.21,52.61 33.21,51.51 33.44,51.27 U5.4 33.57,49.47 34.21,50.11 34.21,50.41 v34.61,50.81
  Top 0.305: D4.2 30.36,17.76 28.91,19.21 25.21,19.21 23.21,21.21 23.21,42.66 23.38,42.83
  Top 0.61: U$3.1 31.31,10.51 31.31,11.41 30.43,12.29 D3.2 30.33,14.11 30.33,16.68
  Bottom 0.152: 32.97,8.41 R23.2 32.88,4.64 | 32.97,8.41 U$3.1 | R22.2 34.93,2.71 33.31,2.71 32.51,3.51 32.51,4.26 32.88,4.64 | v30.71,4.91 32.61,4.91 32.88,4.64 | 32.97,8.41 31.17,6.61 v21.71,6.61 19.81,4.71 13.81,4.71 v13.41,5.11 | v33.21,52.61 C4.2 v34.61,50.81 | C11.2 36.91,52.41 v36.91,51.11 | C25.2 30.01,51.21 29.71,51.51 29.71,51.81 v30.51,52.61 29.31,53.81 R69.2 29.01,60.81 29.01,62.41 28.61,62.81 27.21,62.81 26.51,62.11 R70.2 26.01,60.51 v25.51,61.01 | R25.1 20.16,82.36 D1.CATHODE 21.01,83.91 v20.81,84.11 | C18.2 20.46,74.51 R19.1 18.41,74.51 18.01,74.91 18.01,75.31 17.46,75.86 C17.2 15.96,75.86 15.81,75.71 14.38,75.71 U7.22 12.61,75.81 v11.71,76.71 12.31,77.31 U7.25 | v19.21,70.91 19.46,70.66 R37.2 22.31,71.41 v23.71,71.41
5V
  Top 0.152: LED1.VCC 32.11,43.41 31.26,42.56 31.26,41.59 35.4,37.45 36.59,37.45 38.91,35.13
  Top 0.61: CN8.VCC 42.23,43.81 39.91,43.81 38.91,42.81 38.91,35.13 38.91,33.61 | 38.91,33.61 39.81,32.71 I2C0.VCC | 38.91,33.61 37.91,32.61 37.91,20.61 31.78,14.49 31.78,12.57 U$3.2
  Bottom 0.305: U$3.2 36.11,14.09 36.11,16.31 35.11,17.31 31.91,17.31 31.61,17.61 R53.2 R47.2
AI_ST
  Bottom 0.152: R69.1 30.91,60.61 | 30.91,60.61 30.91,61.01 Q12.S | R2.2 31.14,41.48 31.14,42.34 34.71,45.91 34.71,49.71 31.21,53.21 31.21,60.31 30.91,60.61
AI_TH
  Bottom 0.152: Q13.S 28.16,60.56 R70.1 28.11,60.01 28.61,59.51 28.61,49.71 29.81,48.51 31.81,48.51 32.41,47.91 32.41,45.21 27.54,40.34 R4.2
BEC_60  (via drill 0.35)
  Top 0.152: v26.61,68.31 27.21,68.31 27.81,67.71 28.71,67.71 29.23,68.23 D2.C
  Bottom 0.152: v26.61,68.31 26.41,68.31 26.21,68.11 SJ4.3 25.09,66.71 24.69,66.31 24.69,64.35 22.81,62.47 22.81,59.17 20.24,56.6 20.24,54.95 21.19,54 22.94,54 | C7.2 25.91,55.16 IC1.1 25.69,54.48 24.83,53.62 23.32,53.62 22.94,54 | IC1.3 23.56,54.6 22.96,54 22.94,54
BEC_62
  Top 0.152: 30.71,55.83 U1.1 30.64,54.14 30.11,53.61 | U5.1 33.44,53.94 33.11,53.61 | 30.11,53.61 33.11,53.61 | U6.1 36.34,54.14 35.81,53.61 33.11,53.61 | 30.11,53.61 29.61,53.61 29.48,53.74 | R15.2 28.09,58.93 28.61,58.41 28.61,54.61 29.48,53.74 | R16.2 22.96,58.81 22.21,58.81 21.91,58.51 21.91,55.05 23.22,53.74 29.48,53.74 | OUT_ST.VCC 38.46,68.23 D2.A | RCPWR.ANODE 40.73,56.59 40.73,61.81
  Top 0.61: OUT_TH.VCC 40.73,61.81 40.73,61.73 36.34,57.34 U6.1
  Top 1.27: IN_1CH(ST).VCC IN_2CH(TH).VCC IN_3CH(SELECT).VCC IN_CH4.VCC IN_CH5.VCC OUT_ST.VCC 40.73,61.81
CE0  (via drill 0.35)
  Top 0.152: R57.2 24.01,10.51 24.61,9.91 24.61,4.01 25.21,3.41 26.31,3.41 R62.1 25.51,4.61 25.51,5.51 26.81,6.81 54.41,6.81 54.81,7.21 v54.81,12.51
  Bottom 0.152: v54.81,12.51 55.41,13.11 59.31,13.11 61.12,11.29 U$3.24
CH1  (via drill 0.35)
  Top 0.152: U4.1 3.22,37.9 v3.61,37.51 | U8.6 24.87,46.07 v25.21,46.41
  Bottom 0.152: v3.61,37.51 4.81,36.31 21.41,36.31 27.81,42.71 27.81,44.91 26.31,46.41 v25.21,46.41
CH2  (via drill 0.35)
  Top 0.152: U4.2 5.76,38.16 v6.01,37.91 | v26.51,42.81 26.44,42.87 26.44,44.41 U8.7
  Bottom 0.152: v6.01,37.91 6.71,37.21 20.81,37.21 26.41,42.81 v26.51,42.81
CH3  (via drill 0.35)
  Top 0.152: U1.3 29.37,48.17 R6.1 26.61,50.61 25.21,50.61 23.41,48.81 v23.41,47.81 | U4.3 8.3,38.52 v8.41,38.41
  Bottom 0.152: v8.41,38.41 20.21,38.41 23.41,41.61 v23.41,47.81
CH4  (via drill 0.35)
  Top 0.152: U5.3 32.11,49.4 R9.1 32.11,47.51 v31.41,46.81 | v21.56,35.46 21.24,35.46 18.66,38.04 18.66,40.63 U4.7
  Bottom 0.152: v31.41,46.81 31.41,45.21 21.66,35.46 v21.56,35.46
CH5  (via drill 0.35)
  Top 0.152: U4.8 18.46,56.79 22.15,53.09 23.09,53.09 24.14,52.05 v24.53,52.05 | U6.3 34.91,49.1 R38.1 34.91,46.71 34.05,45.85 29.79,45.85 26.51,49.14 v26.51,49.31
  Bottom 0.152: v26.51,49.31 24.82,51 24.82,51.76 v24.53,52.05
CLOCK
  Top 0.152: SJ2.2 14.41,10.11 15.01,9.51 17.21,9.51 17.74,8.98 17.74,7.94 IC6.23
DATA
  Top 0.152: IC6.24 17.31,8.22 16.82,8.71 14.11,8.71 12.81,7.41 11.51,7.41 10.91,8.01 SJ3.2
GND  (via drill 0.35)
  Top 0.152: R33.2 30.96,82.81 32.81,82.81 33.21,82.41 34.21,82.41 v34.51,82.71 | 30.01,85.41 R32.2 | 30.01,85.41 30.61,86.01 32.41,86.01 32.61,85.81 v34.11,85.81 42.51,85.81 43.27,85.05 IN_1CH(ST).GND IN_2CH(TH).GND IN_3CH(SELECT).GND IN_CH4.GND IN_CH5.GND OUT_ST.GND OUT_TH.GND 43.27,59.65 44.01,58.91 44.01,50.61 43.61,50.21 R7.1 39.61,50.21 v38.31,48.91 37.21,47.81 36.51,47.81 | 30.01,85.41 30.01,85.5 29.31,86.2 26.1,86.2 25.36,85.46 Q5.S 24.31,85.31 v23.61,84.61 23.31,84.61 20.91,82.21 20.91,81.71 v15.91,76.71 18.11,74.51 18.11,73.21 19.11,72.21 19.31,72.21 20.51,71.01 20.51,70.01 20.01,69.51 18.91,69.51 18.01,70.41 v16.21,70.41 | Q4.S 25.36,81.46 26.01,80.81 27.01,80.81 27.61,80.21 27.61,78.31 27.51,78.21 | 27.51,78.21 Q3.S 27.36,77.36 v26.71,76.71 | R24.2 33.91,78.41 v34.61,79.11 | Q1.S 26.41,72.02 26.41,73.61 27.32,74.53 Q2.S 26.42,74.5 v26.21,74.71 | U2.13 5.76,33.96 5.96,34.16 | 5.96,34.16 v6.01,34.21 | U4.13 6.01,57.24 6.01,60.62 4.92,61.71 v3.51,61.71 4.41,62.61 5.11,62.61 v10.51,68.01 | C24.1 24.96,42.66 26.31,41.31 27.01,41.31 | 27.01,41.31 27.61,41.91 27.61,44.51 U8.8 28.31,43.81 v28.91,43.81 | 27.71,33.81 26.51,33.81 25.42,32.72 IC4.1 26.35,32.17 26.81,31.71 26.81,31.41 | 27.71,33.81 28.01,33.81 27.84,33.97 C2.1 29.21,32.27 v29.21,32.11 | 26.81,31.41 26.81,30.91 | 26.81,30.91 26.81,30.11 | 26.81,30.11 26.81,29.91 | 26.81,29.91 26.51,29.61 25.46,29.61 IC4.5 | IC4.4 26.7,30.22 26.81,30.11 | IC4.3 26.77,30.87 26.81,30.91 | IC4.2 26.7,31.52 26.81,31.41 | R3.1 34.93,24.33 C3.2 35.11,25.66 R1.1 | U$9.1 57.56,20.46 58.21,21.11 68.11,21.11 69.36,19.86 U$10.1
  Top 0.152: IC6.11 18.91,4.01 19.21,3.71 19.81,3.71 20.16,3.36 C28.1 | C28.1 20.16,1.66 19.71,1.21 17.21,1.21 SJ1.2 15.91,1.61 15.01,2.51 | C26.1 15.01,2.51 | 22.21,7.41 21.61,7.41 | 21.61,7.41 IC6.18 | 22.21,7.41 22.96,6.66 C27.1 22.96,4.96 24.31,3.61 24.31,2.11 23.61,1.41 21.46,1.41 C28.1 | IC6.20 18.91,8.51 19.31,8.91 20.71,8.91 21.11,8.51 21.11,7.91 21.61,7.41 | U$3.14 50.67,13.41 55.11,13.41 56.04,12.47 56.04,11.21 | 56.04,11.21 U$3.20 | U$3.30 68.74,10.85 67.81,9.91 64.95,9.91 U$3.25 62.38,9.91 57.34,9.91 56.04,11.21 | U$3.30 70,9.91 72.61,9.91 73.82,11.13 U$3.34 75.08,9.91 80.16,9.91 U$3.39 | IC4.14 25.61,23.72 | 25.61,23.72 26.62,23.72 26.81,23.91 26.81,29.91 | U$11.#2 33.26,30.16 v34.01,30.91 | IC4.24 30.55,29.57 v29.81,30.31 27.71,32.41 27.71,33.81 | 22.21,7.41 v22.21,8.61 | v26.01,12.31 26.31,12.61 28.21,12.61 29.01,13.41 29.01,17.31 28.21,18.11 v25.41,18.11 | v25.51,20.61 25.51,23.62 25.61,23.72 | C1.2 36.31,28.21 36.71,27.81 36.71,26.51 35.98,25.78 R1.1 | R1.1 35.23,25.38 v36.41,24.21 | v39.11,22.91 40.41,21.61 v40.41,19.11 | LED1.GND 36.31,44.21 v36.31,44.31 | 36.51,47.81 v36.51,46.71 37.71,45.51 CN8.GND | 36.51,47.81 R38.2 | R6.2 30.81,47.51 v30.11,46.81 | R9.2 33.71,46.81 v33.61,46.71 | v30.21,41.91 29.61,41.31 27.01,41.31 | v35.21,34.81 35.21,36.01 v35.71,36.51 35.23,36.51 v33.75,37.99 | I2C0.GND 42.21,34.71 v41.01,35.91 40.31,36.61 v40.31,38.81 v40.31,40.41 40.31,42.01 v40.81,42.51 | v16.01,63.21 15.01,64.21 15.01,67.61 13.41,69.21 v12.51,69.21 | v11.91,65.51 11.31,65.51 v10.51,66.31 | v67.31,15.61 68.74,14.17 U$3.30 | R18.2 33.12,71.9 34.51,70.51 35.71,70.51 36.81,71.61 v36.81,73.31
  Top 0.152: R17.2 32.7,76.11 36.51,76.11 v36.61,76.01 | v28.41,79.11 28.21,78.91 28.21,78.61 27.81,78.21 27.51,78.21 | v1.31,36.81 2.31,35.81 v2.31,33.91 3.71,35.31 v4.21,35.31 4.81,35.31 5.96,34.16 | v41.01,27.71 40.21,27.71 v39.21,26.71 v41.11,24.81 42.21,24.81 v43.61,23.41 | 15.01,2.51 14.21,3.31 v14.21,3.41 13.01,3.41 11.31,5.11 v11.31,5.31 | v9.21,7.41 v9.21,5.31 | v7.01,7.51 7.01,8.21 v5.01,10.21 | v40.78,5.71 40.78,4.53 v39.51,3.26 | v42.35,4.38 42.96,4.38 v44.25,5.67 | v45.57,4.65 44.31,3.39 v44.31,3.32 | v49.19,5.43 51.23,3.39 v51.42,3.39 | v50.51,2.42 51.21,1.72 v52.79,1.72 | v55.93,1.5 59.31,1.5 v59.38,1.43 | v65.34,13.42 67.31,15.39 v67.31,15.61 | v67.31,15.61 71.52,15.61 v71.79,15.34
  Bottom 0.152: 34.51,82.81 v34.51,82.71 34.61,82.61 v34.61,79.11 35.11,79.11 36.41,77.81 36.41,76.21 v36.61,76.01 36.61,73.51 v36.81,73.31 | 34.51,82.81 34.51,85.41 v34.11,85.81 | C5.1 30.26,77.86 30.91,77.21 32.01,77.21 32.73,76.48 U$1.15 | U$3.9 44.63,9.91 47.17,9.91 U$3.14 48.42,12.09 v47.11,13.41 | 29.91,30.31 33.41,30.31 v34.01,30.91 36.41,28.51 v36.41,24.21 37.81,24.21 v39.11,22.91 39.21,23.01 v39.21,26.71 | 29.91,30.31 v29.81,30.31 | v26.01,12.31 25.91,12.31 v22.21,8.61 23.01,7.81 v23.51,7.81 | v25.51,20.61 25.41,20.51 v25.41,18.11 25.01,18.11 v23.71,19.41 | U$3.9 42.11,9.87 42.11,17.41 v40.41,19.11 | Q7.S 29.46,25.86 30.41,24.91 31.91,24.91 32.46,25.46 Q10.S 32.46,26.46 29.91,29.01 29.91,30.31 | v36.31,44.31 36.51,44.51 v36.51,46.71 | C4.1 C11.1 38.31,52.71 v38.31,48.91 | v30.11,46.81 30.11,45.01 v28.91,43.81 | C25.1 33.61,48.81 v33.61,46.71 33.61,45.61 30.21,42.21 v30.21,41.91 29.11,40.81 29.11,40.11 31.26,37.95 32.34,37.95 32.37,37.99 v33.75,37.99 | v29.21,32.11 31.31,34.21 31.31,34.51 31.61,34.81 v35.21,34.81 | v41.01,35.91 40.51,35.91 39.91,36.51 v35.71,36.51 | v26.21,74.71 25.81,75.11 25.81,76.41 26.11,76.71 v26.71,76.71 23.61,79.81 v23.61,84.61 22.31,83.31 22.31,78.01 21.96,77.66 R36.1 | R5.1 20.16,68.21 C16.1 | C12.1 20.41,78.01 20.76,78.01 R36.1 | C17.1 20.71,75.86 C18.1 20.76,76.36 21.11,76.71 R36.1 | C16.1 18.61,66.66 C13.1 18.61,64.21 17.26,62.86 C23.1 17.21,62.51 | 17.21,62.51 16.71,62.51 v16.01,63.21 | v12.51,69.21 13.11,69.21 13.21,69.31 U7.9 | v12.51,69.21 13.11,69.81 U7.10 15.61,69.81 v16.21,70.41 16.21,71.31 15.71,71.81 U7.14 12.91,71.81 12.71,72.01 12.71,72.31
  Bottom 0.152: U7.8 12.91,68.81 | 12.91,68.81 v12.51,69.21 | U7.7 13.41,68.31 12.91,68.81 | U7.6 12.81,67.81 12.51,68.11 | 12.51,68.11 v12.51,69.21 | U7.2 12.81,65.81 12.31,66.31 | 12.31,66.31 12.31,67.91 12.51,68.11 | 12.31,66.31 11.91,65.91 v11.91,65.51 | v10.51,66.31 v10.51,68.01 | U$10.1 69.36,17.66 v67.31,15.61 | U$1.8 28.83,71.03 29.41,71.61 29.41,72.91 28.01,74.31 28.01,76.11 30.21,78.31 C5.1 | U7.23 15.51,76.31 v15.91,76.71 | 12.71,72.31 U7.15 | 12.71,72.31 12.71,73.51 | U7.18 13.01,73.81 12.71,73.51 | 12.71,73.51 12.71,74.21 | 12.71,74.21 12.81,74.31 U7.19 | U7.21 12.91,75.31 12.71,75.11 12.71,74.61 | 12.71,74.61 12.71,74.21 | C5.1 29.21,78.31 v28.41,79.11 | R13.2 18.66,68.41 C16.1 | 17.21,62.51 17.21,61.91 17.71,61.41 19.49,61.41 U$8.3 | CN8.GND 42.11,45.51 40.81,44.21 v40.81,42.51 40.71,42.41 39.31,42.41 38.31,41.41 38.31,41.31 36.91,39.91 34.81,39.91 v34.21,40.51 | 1.31,40.21 1.31,59.51 3.41,61.61 | 1.31,40.21 v1.31,36.81 | 3.41,61.61 v3.51,61.71 3.51,60.41 2.91,59.81 | v7.71,70.91 6.71,71.91 v6.71,72.51 | v6.71,72.51 v6.71,74.91 8.01,76.21 v8.11,76.21 v6.81,77.51 6.81,77.61 v8.11,78.91 7.81,78.91 v6.71,80.01 7.91,81.21 v7.91,81.31 | v7.91,81.31 6.61,82.61 v6.61,82.71 5.31,84.01 v5.11,84.01 | v5.11,84.01 5.01,84.01 v3.81,85.21 2.71,84.11 v2.61,84.11 | v5.11,84.01 5.61,84.01 v6.71,85.11 | v8.31,83.91 9.21,83.01 v9.21,82.51 | v9.21,82.51 8.01,81.31 v7.91,81.31 | v9.21,82.51 10.41,83.71 v10.61,83.71 11.81,84.91 v11.91,84.91 12.21,84.91 v13.31,83.81 | v13.31,83.81 14.01,83.81 v14.81,84.61 | v14.61,82.51 v13.31,83.81 | v36.01,81.81 35.01,82.81 34.51,82.81 | v36.01,81.81 36.01,83.71 37.01,84.71 v38.21,84.71
  Bottom 0.152: v36.31,79.01 36.01,79.31 v36.01,81.81 | v6.71,72.51 7.71,73.51 v8.31,73.51 9.51,74.71 v9.51,74.91 | v9.51,74.91 9.51,77.61 v9.41,77.71 v10.71,79.01 | v9.51,74.91 v10.81,73.61 | v10.81,73.61 10.81,73.41 v9.51,72.11 | v10.81,73.61 10.81,73.51 v11.81,72.51 11.81,74.51 v12.01,74.71 12.61,74.71 12.71,74.61 | v43.61,23.41 43.61,22.71 v42.11,21.21 42.91,20.41 v42.91,19.41 44.61,21.11 v44.91,21.11 45.61,21.11 v47.21,19.51 47.21,17.81 v47.11,17.71 43.61,17.71 v42.81,16.91 43.01,16.71 v43.01,13.41 | v43.01,13.41 41.11,13.41 v40.31,14.21 40.21,14.21 v38.61,15.81 | v47.11,13.41 v43.01,13.41 | v47.11,13.41 50.31,13.41 51.56,14.66 | 51.56,14.66 v51.61,14.71 51.41,14.91 v51.41,17.61 51.31,17.71 v51.31,19.41 | U$9.1 57.56,16.16 56.06,14.66 51.56,14.66 | v1.61,62.61 2.41,62.61 3.41,61.61 | v2.81,59.81 2.91,59.81 | 2.91,59.81 4.51,59.81 v4.71,60.01 4.71,60.71 v5.91,61.91 | v23.71,19.41 23.71,22.01 v24.41,22.71 | v22.61,16.01 23.71,17.11 v23.71,19.41 | v11.31,5.31 v9.21,7.41 | v9.21,5.31 v7.01,7.51 | C8.1 26.61,58.91 27.11,58.41 27.11,56.96 | 27.11,56.96 C7.1 26.16,56.01 24.85,56.01 24.51,55.67 | 1.31,40.21 2.11,41.01 17.11,41.01 21.65,45.55 21.65,48.32 20.75,49.22 20.75,52.35 20.8,52.4 | U$3.9 43.34,8.28 v40.78,5.71 | v39.51,3.26 41.23,3.26 v42.35,4.38 | v44.25,5.67 44.55,5.67 v45.57,4.65 48.41,4.65 v49.19,5.43 | v51.42,3.39 50.51,2.48 v50.51,2.42 | v52.79,1.72 52.99,1.72 v53.85,2.58 54.85,2.58 v55.93,1.5 | C6.1 22.9,55.95 24.23,55.95 24.51,55.67 | IC1.2 24.51,55.67 | 20.8,52.4 21.43,53.03 26.82,53.03 28.14,54.35 28.14,55.93 27.11,56.96 | R45.2 18.51,54.69 20.8,52.4
  pour Bottom (rank 6): -10.09,89.31 92.91,89.31 92.91,-1.49 -10.09,-1.49
  pour Top (rank 6): -10.89,90.11 93.71,90.11 93.71,-2.89 -10.89,-2.89
LED0  (via drill 0.35)
  Top 0.152: IC4.6 25,28.92 24.61,29.31 24.61,33.31 26.61,35.31 29.71,35.31 32.11,37.71 v32.11,38.51
  Bottom 0.152: R2.1 31.91,38.51 v32.11,38.51
LED1  (via drill 0.35)
  Top 0.152: v30.01,38.01 30.01,36.61 29.21,35.81 26.11,35.81 23.91,33.61 23.91,28.81 24.45,28.27 IC4.7
  Bottom 0.152: R4.1 28.84,38.41 29.61,38.41 v30.01,38.01
LED9  (via drill 0.35)
  Top 0.152: IC4.16 31.85,24.37 32.31,23.91 32.31,23.01 31.81,22.51 29.01,22.51 v28.81,22.71
  Bottom 0.152: v28.81,22.71 28.81,24.14 28.48,24.47 25.05,24.47 24.11,25.41 24.11,28.51 25.41,29.81 28.11,29.81 28.31,29.61 R54.2
LED9-D
  Bottom 0.152: Q10.D 33.04,22.03 LED9.2
LED9_G
  Bottom 0.152: R54.1 30.01,27.11 30.56,26.56 Q10.G
LED10  (via drill 0.35)
  Top 0.152: IC4.17 30.62,25.02 v29.91,24.31
  Bottom 0.152: v29.91,24.31 29.71,24.31 29.01,25.01 25.71,25.01 24.91,25.81 24.91,27.91 25.71,28.71 R48.2
LED10-D
  Bottom 0.152: LED10.2 27.44,22.99 Q7.D
LED10-G
  Bottom 0.152: Q7.G 27.06,26.96 R48.1
MISO  (via drill 0.35)
  Top 0.152: IC6.9 18.11,3.91 17.81,3.61 16.31,3.61 | SJ1.1 16.71,3.21 16.31,3.61 | R62.2 27.31,2.91 v26.61,2.21 | v15.71,3.81 15.91,3.61 16.31,3.61 | v52.81,5.01 53.31,5.01 v54.71,3.61
  Bottom 0.152: v15.71,3.81 16.51,3.01 19.51,3.01 21.11,4.61 23.81,4.61 26.21,2.21 v26.61,2.21 27.61,3.21 31.51,3.21 32.61,2.11 48.81,2.11 51.71,5.01 v52.81,5.01 | v54.71,3.61 55.91,3.61 58.58,6.29 U$3.21
MOSI
  Top 0.152: SJ3.1 9.91,10.31 10.31,9.91 10.31,4.11 13.71,0.71 27.71,0.71 | 27.71,0.71 53.86,0.71 56.04,2.9 U$3.19 | R62.4 28.91,1.91 27.71,0.71
MOTORCONTROLPOWER
  Top 0.254: U$9.6 65.06,18.76 66.01,17.81 75.51,17.81 76.86,19.16 U$10.6
N$2
  Top 0.152: IC6.22 18.11,8.91 18.81,9.61 19.61,9.61 20.31,10.31 20.31,10.41 | 20.31,10.41 R58.1 | R57.1 21.51,10.41 20.31,10.41
N$3
  Bottom 0.152: C22.2 15.91,81.81 15.91,79.91 15.31,79.31 U7.29
N$4  (via drill 0.35)
  Top 0.152: v35.41,73.11 35.3,73.21 27.58,73.21 27.51,73.14 v27.51,73.11
  Bottom 0.152: v35.41,73.11 33.36,71.06 33.36,69.23 U$1.1 | v27.51,73.11 27.11,73.11 24.21,70.21 24.21,69.71 R5.2 22.71,66.51 22.91,66.31 R63.2
N$5
  Top 0.152: IC6.12 19.4,4.82 19.4,4.65 19.64,4.41 21.21,4.41 INT.1
N$6
  Top 0.152: U1.2 29.37,56.92 R26.1
N$7
  Top 0.152: R3.2 33.15,24.11 33.11,24.11 32.31,24.91 32.31,28.41 31.8,28.92 IC4.23
N$9
  Top 0.152: U8.1 27.41,55.91 27.91,56.41 27.91,57.25 R15.1
N$12
  Top 0.152: U8.4 23.03,55.88 R16.1
N$13  (via drill 0.35)
  Top 0.152: LED1.SDO 33.41,41.81 32.91,41.31 32.91,40.86 35.66,38.11 v37.11,38.11
  Bottom 0.152: v37.11,38.11 37.41,37.81 41.41,37.81 42.53,38.93 CN8.DI
N$14
  Bottom 0.152: U7.5 15.31,67.31 16.46,68.46 R13.1
N$15  (via drill 0.35)
  Top 0.152: v32.31,42.41 32.51,42.61 LED1.CKO
  Bottom 0.152: CN8.CI 39.81,41.51 37.21,38.91 34.59,38.91 34.13,39.37 32.9,39.37 31.63,40.63 31.63,41.73 v32.31,42.41
N$16
  Bottom 0.152: U7.27 18.91,78.31 19.11,78.11 C19.2
N$17
  Bottom 0.152: U7.3 15.51,66.31 15.81,66.01 15.81,65.21 16.21,64.81 C13.2
N$18
  Bottom 0.152: R31.2 15.96,73.06 15.71,73.31 U7.17
N$20
  Top 0.152: U$9.2 59.06,19.06 57.81,17.81 56.81,17.81 55.91,18.71 55.91,19.31 55.3,19.91 R39.1
  Bottom 0.152: R42.2 58.9,19.38 U$9.2
N$21
  Bottom 0.152: U7.26 15.71,77.81 16.16,77.36 C19.1
N$22
  Bottom 0.152: U7.28 15.61,78.81 16.41,79.61 16.41,81.71 17.01,82.31 18.71,82.31 19.06,82.66 C22.1
N$23
  Top 0.152: Q3.G 29.61,78.41 R24.1 30.51,77.01 R8.1
N$24
  Top 0.152: RCPWR.CATHODE 42.51,53.21 R7.2
N$25
  Bottom 0.152: U7.4 16.86,66.81 C16.2
N$26
  Top 0.152: R26.2 27.11,61.66 27.11,64.81 25.21,66.71 25.21,75.11 25.86,75.76 Q3.D
N$27
  Top 0.152: Q4.D 26.31,78.51 24.41,76.61 24.41,65.81 26.41,63.81 26.41,59.01 R27.2
N$28
  Top 0.152: U8.2 26.14,57.14 R27.1
N$29
  Top 0.152: 26.01,83.01 Q5.D 24.81,83.01 22.71,80.91 22.71,72.11 22.11,71.51 22.11,70.71 22.81,70.01 22.81,64.81 24.66,62.96 R29.2
N$30
  Top 0.152: U8.3 24.87,56.94 R29.1
N$31
  Top 0.152: U$9.3 60.56,17.76 59.91,17.11 56.01,17.11 55,18.12 R40.1
  Bottom 0.152: R43.2 60.62,19.48 U$9.3
N$32  (via drill 0.35)
  Top 0.152: v20.01,72.61 21.51,74.11 v21.51,80.71
  Bottom 0.152: C12.2 R25.2 17.41,81.01 18.11,80.31 20.21,80.31 21.01,79.51 D1.ANODE 21.01,80.21 v21.51,80.71 | R31.1 19.56,73.06 v20.01,72.61
N$33
  Top 0.152: Q5.G 27.61,84.96 R32.1 R34.2
N$34
  Top 0.305: D4.1 24.41,16.71 22.51,18.61 22.51,41.11 18.81,44.81 18.81,49.61 15.41,53.01 9.31,53.01 8.3,54.02 U4.12
N$35
  Top 0.152: OUT_TH.I/O 33.47,62.15 32.11,63.51 31.51,63.51 30.64,64.38 R21.2
N$36
  Top 0.152: R20.2 33.66,65.96 OUT_ST.I/O
N$37
  Bottom 0.152: R36.2 23.11,74.21 R37.1 21.56,72.36 20.81,71.61 19.91,71.61 19.61,71.91 16.31,71.91 15.41,72.81 U7.16
N$38
  Top 0.152: R35.2 R33.1 28.46,81.91 Q4.G
N$40
  Top 0.152: U$9.4 62.06,17.36 61.02,16.32 R41.1
  Bottom 0.152: R44.2 62.12,19.48 U$9.4
N$41
  Top 0.152: IC4.25 31.9,30.22 32.21,29.91 32.21,29.31 32.41,29.11 32.86,29.11 U$11.#3 33.01,27.96 C3.1 33.63,27.38 R1.2
N$42  (via drill 0.35)
  Top 0.152: U$9.5 63.56,17.96 65.01,16.51 v73.11,16.51
  Bottom 0.152: v73.11,16.51 75.36,18.76 U$10.5
N$45
  Top 0.152: D3.1 27.4,14.14
  Top 0.305: D3.1 25.9,14.01 17.11,22.81 17.11,26.31 15.91,27.51 9.11,27.51 8.3,28.32 U2.12
N$46
  Top 0.152: R10.2 31.14,62.91 29.91,62.91 25.71,67.11 25.71,68.71 26.21,69.21 27.87,69.21 Q1.D
N$47  (via drill 0.35)
  Top 0.152: Q2.D 28.81,72.71 33.91,72.71 v35.31,71.31 | v33.51,57.81 33.51,58.71 33.01,59.21 32.26,59.21 R14.2
  Bottom 0.152: v35.31,71.31 36.31,70.31 36.31,56.31 35.81,55.81 34.01,55.81 33.51,56.31 v33.51,57.81
N$48
  Top 0.152: Q2.G 29.25,74.95 29.77,75.47 30.41,75.47 | 30.41,75.47 R17.1 | R28.2 30.5,75.38 30.41,75.47
N$49
  Top 0.152: Q1.G 29.3,71.12 | 29.3,71.12 30.07,71.9 R18.1 | R30.2 30.02,70.4 29.3,71.12
N$50
  Bottom 0.152: R19.2 15.71,74.51 15.41,74.81 U7.20
N$51
  Top 0.152: U5.2 32.17,57.47 R14.1
N$52
  Top 0.152: U6.2 35.07,57.38 R10.1
N$55  (via drill 0.35)
  Top 0.152: R39.2 52.52,20.21 42.62,20.21 39.11,16.71 35.51,16.71 v34.71,15.91 | v4.31,12.01 3.22,13.1 U2.1
  Bottom 0.152: v34.71,15.91 33.81,15.01 23.61,15.01 18.99,10.39 14.7,10.39 13.08,12.01 v4.31,12.01
N$56  (via drill 0.35)
  Top 0.152: R40.2 52.32,18.52 43.11,18.52 39.41,14.81 34.71,14.81 v34.11,14.21 | v6.81,10.71 5.76,11.76 U2.2
  Bottom 0.152: v34.11,14.21 34.01,14.11 24.39,14.11 19.74,9.46 13.8,9.46 12.55,10.71 v6.81,10.71
N$57  (via drill 0.35)
  Top 0.152: R41.2 52.22,16.82 44.12,16.82 40.41,13.11 v33.15,13.11 | v9.41,9.41 8.3,10.52 U2.3
  Bottom 0.152: v33.15,13.11 24.93,13.11 20.36,8.54 13.66,8.54 12.61,9.59 9.59,9.59 v9.41,9.41
N$58
  Bottom 0.152: R42.1 58.9,15.62 59.91,14.61 67.81,14.61 70.86,17.66 U$10.2
N$59
  Bottom 0.152: 60.71,16.24 R43.1 60.62,15.5 60.81,15.31 64.81,15.31 67.21,17.71 67.21,20.01 68.01,20.81 71.41,20.81 72.36,19.86 U$10.3
N$60
  Bottom 0.152: R44.1 64.63,16.34 66.31,18.01 66.31,20.61 67.2,21.5 72.31,21.5 73.86,19.96 U$10.4
N$64
  Bottom 0.152: R45.1 20.38,58.02 20.76,58.02 22.17,59.43 U$8.1
N$65
  Bottom 0.152: C6.2 22.56,57.31 IC1.4
N$66
  Bottom 0.152: R47.1 27.61,19.01 28.31,19.71 29.21,19.71 29.98,20.48 LED10.1
N$67
  Top 0.152: INT1.1 18.46,13.27 U2.7
N$68
  Top 0.152: U2.8 18.46,33.92 INT2.1
N$75
  Bottom 0.152: R53.1 33.31,18.71 34.51,18.71 35.58,19.78 LED9.1
N$87
  Top 0.152: U2.11 10.84,33.48 MOSI.1
N$88
  Top 0.152: U2.10 13.38,33.04 12.21,34.21 MISO.1
N$89
  Top 0.152: U2.9 15.92,33.8 SCLK.1
N$95  (via drill 0.35)
  Top 0.152: v19.21,60.51 19.21,62.91 v20.21,63.91
  Bottom 0.152: R63.1 21.31,64.91 21.21,64.91 20.27,63.97 | R64.2 19.01,60.31 v19.21,60.51 | v20.21,63.91 20.27,63.97 | U$8.4 20.87,63.38 20.27,63.97
N$96
  Bottom 0.152: Q12.G 33.71,61.81 R65.1
N$99
  Bottom 0.152: Q13.G 30.06,59.86 30.41,59.51 R67.1
PCA9685_ST
  Bottom 0.152: Q12.D 32.71,65.41 32.86,65.56 | 32.86,65.56 R66.1 | U$1.3 32.08,67.53 32.86,66.76 32.86,65.56
PCA9685_TH
  Bottom 0.152: Q13.D 29.91,64.96 R68.1 29.91,66.81 30.41,67.31 30.41,68.01 30.11,68.31 30.11,69.18 U$1.6
PCH1
  Top 0.152: R12.1 32.66,85.16 33.41,84.41 36.25,84.41 IN_1CH(ST).I/O
PCH2
  Top 0.152: R11.1 32.31,82.01 33.41,80.91 37.21,80.91 IN_2CH(TH).I/O
PCH3
  Top 0.152: IN_3CH(SELECT).I/O 37.76,76.96 R8.2
PCH_4
  Top 0.152: IN_CH4.I/O 37.86,74.85 37.11,74.1 R28.1
PCH_5
  Top 0.152: R30.1 33.42,70.4 34.21,69.61 37.65,69.61 38.19,70.15 IN_CH5.I/O
PLEX_VCC
  Bottom 0.152: R66.2 31.31,63.61 31.91,63.01 | 31.91,63.01 32.41,63.01 32.71,62.71 32.71,61.31 32.11,60.71 R65.2 32.01,60.41 R67.2 | 31.96,78.16 C5.2 | C23.2 19.27,62.51 | 19.27,62.51 19.51,62.51 | 31.91,63.01 29.11,63.01 28.81,63.31 28.21,63.31 27.81,63.71 27.81,65.21 28.21,65.61 | 28.21,65.61 R68.2 26.79,65.71 | C5.2 31.96,80.16 31.71,80.41 28.21,80.41 27.51,79.71 27.51,74.11 28.71,72.91 28.71,71.61 28.21,71.11 28.21,65.61 | 26.79,65.71 27.66,66.58 27.66,69.21 26.66,70.21 25.71,70.21 23.81,68.31 23.81,64.41 22.17,62.77 U$8.5 22.17,61.73 21.54,61.1 20.68,61.1 19.27,62.51 | SJ4.2 26.79,65.71 | U$1.16 33.38,76.88 C5.2
RC3V3
  Bottom 0.152: IC1.5 24.91,57.31 23.76,58.46 C8.2 23.76,62.66 25.81,64.71 SJ4.1
RCH1  (via drill 0.35)
  Top 0.152: v31.51,67.11 31.61,67.11 31.83,66.88 31.83,65.93 R20.1
  Bottom 0.152: v31.51,67.11 31.46,67.16 31.43,67.18 U$1.4
RCH2  (via drill 0.35)
  Top 0.152: R21.1 29.84,65.98 29.11,66.71 v29.11,67.01
  Bottom 0.152: v29.11,67.01 29.11,67.41 29.48,67.78 U$1.7
RECV_CH1  (via drill 0.35)
  Top 0.152: R34.1 30.11,83.56 R12.2 32.96,83.56 v33.21,83.31
  Bottom 0.152: v33.21,83.31 33.21,81.41 33.91,80.71 33.91,78.71 35.61,77.01 35.61,75.01 33.78,73.18 33.78,72.71 | 33.78,72.71 33.78,72.68 | U$1.2 32.73,71.66 33.78,72.71
RECV_CH2  (via drill 0.35)
  Top 0.152: R35.1 31.46,80.46 R11.2 32.31,80.41 v33.11,79.61
  Bottom 0.152: v33.11,79.61 33.11,78.41 34.81,76.71 34.81,75.21 30.78,71.18 U$1.5
REGOUT
  Top 0.152: IC6.10 18.51,2.76 C28.2
SCL  (via drill 0.35)
  Top 0.152: v21.41,33.91 21.41,34.22 15.92,39.71 U4.6 16.21,41.12 v16.21,43.51 | v16.81,18.81 15.92,17.92 U2.6 15.92,12.1 15.41,11.59 SJ2.3 | I2C0.SCL 41.41,28.71 v39.71,30.41 | IC4.26 32.17,30.87 33.51,32.21 v33.51,32.61
  Bottom 0.152: v16.81,18.81 19.61,21.61 19.61,33.51 20.01,33.91 v21.41,33.91 24.61,37.11 34.91,37.11 35.51,37.71 36.21,37.71 36.81,37.11 42.71,37.11 44.21,35.61 44.21,30.31 42.51,28.61 | v16.21,43.51 16.21,55.31 11.41,60.11 9.81,60.11 8.31,61.61 8.31,68.81 10.81,71.31 U7.13 | R22.1 38.81,4.32 38.81,8.09 U$3.5 38.26,8.87 39.51,10.11 39.51,12.01 37.71,13.81 37.71,18.41 42.21,22.91 42.21,28.31 42.51,28.61 | 42.51,28.61 I2C0.SCL | v33.51,32.61 34.41,32.61 36.61,30.41 v39.71,30.41
SCLK  (via drill 0.35)
  Top 0.152: SJ2.1 13.41,9.61 v12.31,8.51 | v28.01,2.21 28.11,2.31 R62.3
  Bottom 0.152: v12.31,8.51 12.31,3.91 14.91,1.31 27.11,1.31 v28.01,2.21 31.31,2.21 32.11,1.41 51.01,1.41 54.73,5.13 54.73,9.19 55.45,9.91 60.21,9.91 61.12,8.99 U$3.23
SDA  (via drill 0.35)
  Top 0.152: 13.53,40.83 U4.5 | v13.51,18.21 13.38,18.08 U2.5 13.38,13.68 11.91,12.21 SJ3.3 | IC4.27 31.81,31.51 32.11,31.81 32.11,33.11 v32.61,33.61 | v20.41,33.01 19.89,33.53 19.89,34.73 17.62,37 15.2,37 13.53,38.67 13.53,40.52 13.53,40.83 | v13.96,43.37 13.53,42.94 13.53,40.83
  Bottom 0.152: v13.51,18.21 16.01,18.21 16.71,17.51 18.11,17.51 21.11,20.51 21.11,29.01 20.71,29.41 20.71,32.71 20.51,32.91 | 20.51,32.91 v20.41,33.01 | 11.51,70.31 U7.11 | 11.51,70.31 9.51,68.31 9.51,62.51 10.81,61.21 13.11,61.21 17.51,56.81 17.51,42.91 17.01,42.41 15.91,42.41 14.95,43.37 v13.96,43.37 | U7.12 12.01,70.81 11.51,70.31 | U$3.3 35.81,8.55 35.81,7.21 34.1,5.5 R23.1 37.01,6.5 37.01,19.41 40.16,22.56 40.16,29.06 41.41,30.31 42.11,30.31 I2C0.SDA 42.46,30.76 | 42.46,30.76 40.31,32.91 40.31,34.81 39.21,35.91 25.31,35.91 22.31,32.91 20.51,32.91 | 42.46,30.76 40.96,30.76 37.81,33.91 32.91,33.91 v32.61,33.61
SIGNAL_SELECT  (via drill 0.35)
  Top 0.152: U4.4 10.84,41.59 12.31,43.06 v12.31,45.61 | v6.91,68.41 8.41,69.91 10.41,69.91 14.51,65.81 v14.51,62.41
  Bottom 0.152: v12.31,45.61 13.01,46.31 14.71,46.31 15.41,47.01 15.41,54.11 10.51,59.01 8.31,59.01 6.91,60.41 v6.91,68.41 | v14.51,62.41 14.51,61.31 15.51,60.31 R64.1 17.61,58.81 20.74,58.81 21.52,59.59 U$8.2
SPI-LED-CLK  (via drill 0.35)
  Top 0.152: LED1.CKI 36.71,42.61 37.31,43.21 37.31,44.71 36.81,45.21 29.51,45.21 v27.11,47.61 | U4.9 15.92,55.9 18.71,53.11 20.91,53.11 21.72,52.3 22.76,52.3 v22.93,52.13
  Bottom 0.152: v27.11,47.61 22.93,51.79 v22.93,52.13
SPI-LED-SDI  (via drill 0.35)
  Top 0.152: LED1.SDI 36.51,41.81 v36.91,41.41 | v34.71,44.51 29.41,44.51 27.41,46.51 27.01,46.51 v24.81,48.71 | U4.11 10.84,55.98 12.51,54.31 15.81,54.31 18.21,51.91 20.91,51.91 21.81,51.01 v22.21,51.01
  Bottom 0.152: v36.91,41.41 36.91,40.91 36.51,40.51 35.61,40.51 35.21,40.91 35.21,44.01 v34.71,44.51 | v24.81,48.71 22.51,51.01 v22.21,51.01

### Text on the board
tPlace: 1ch | 2ch | 3ch | 4ch | 5ch | SIG | VCC | ST | TH | 1 | MS_OUTPUT | MS_INPUT | 23Spec | 1 | Rev 3.1.0
bPlace: S/N | Rev 3.1.0 | F-612-3-1-0-A-N-J-1-JLC
Document: #612 JetRacer Rev 3.1.0 23Spec / for Jetson Orin Nano / 2023/09/23
_tNames: 0.96OLED(B) | MC74VHC127 | ESP32-S3 | MOTOR SENSOR | OUTPUT | INPUT | ESP32-S3 | IMU Sensor